# EAGLE design InkTime_NAN (EAGLE 9.7.0)

## Sheet 1 of 2
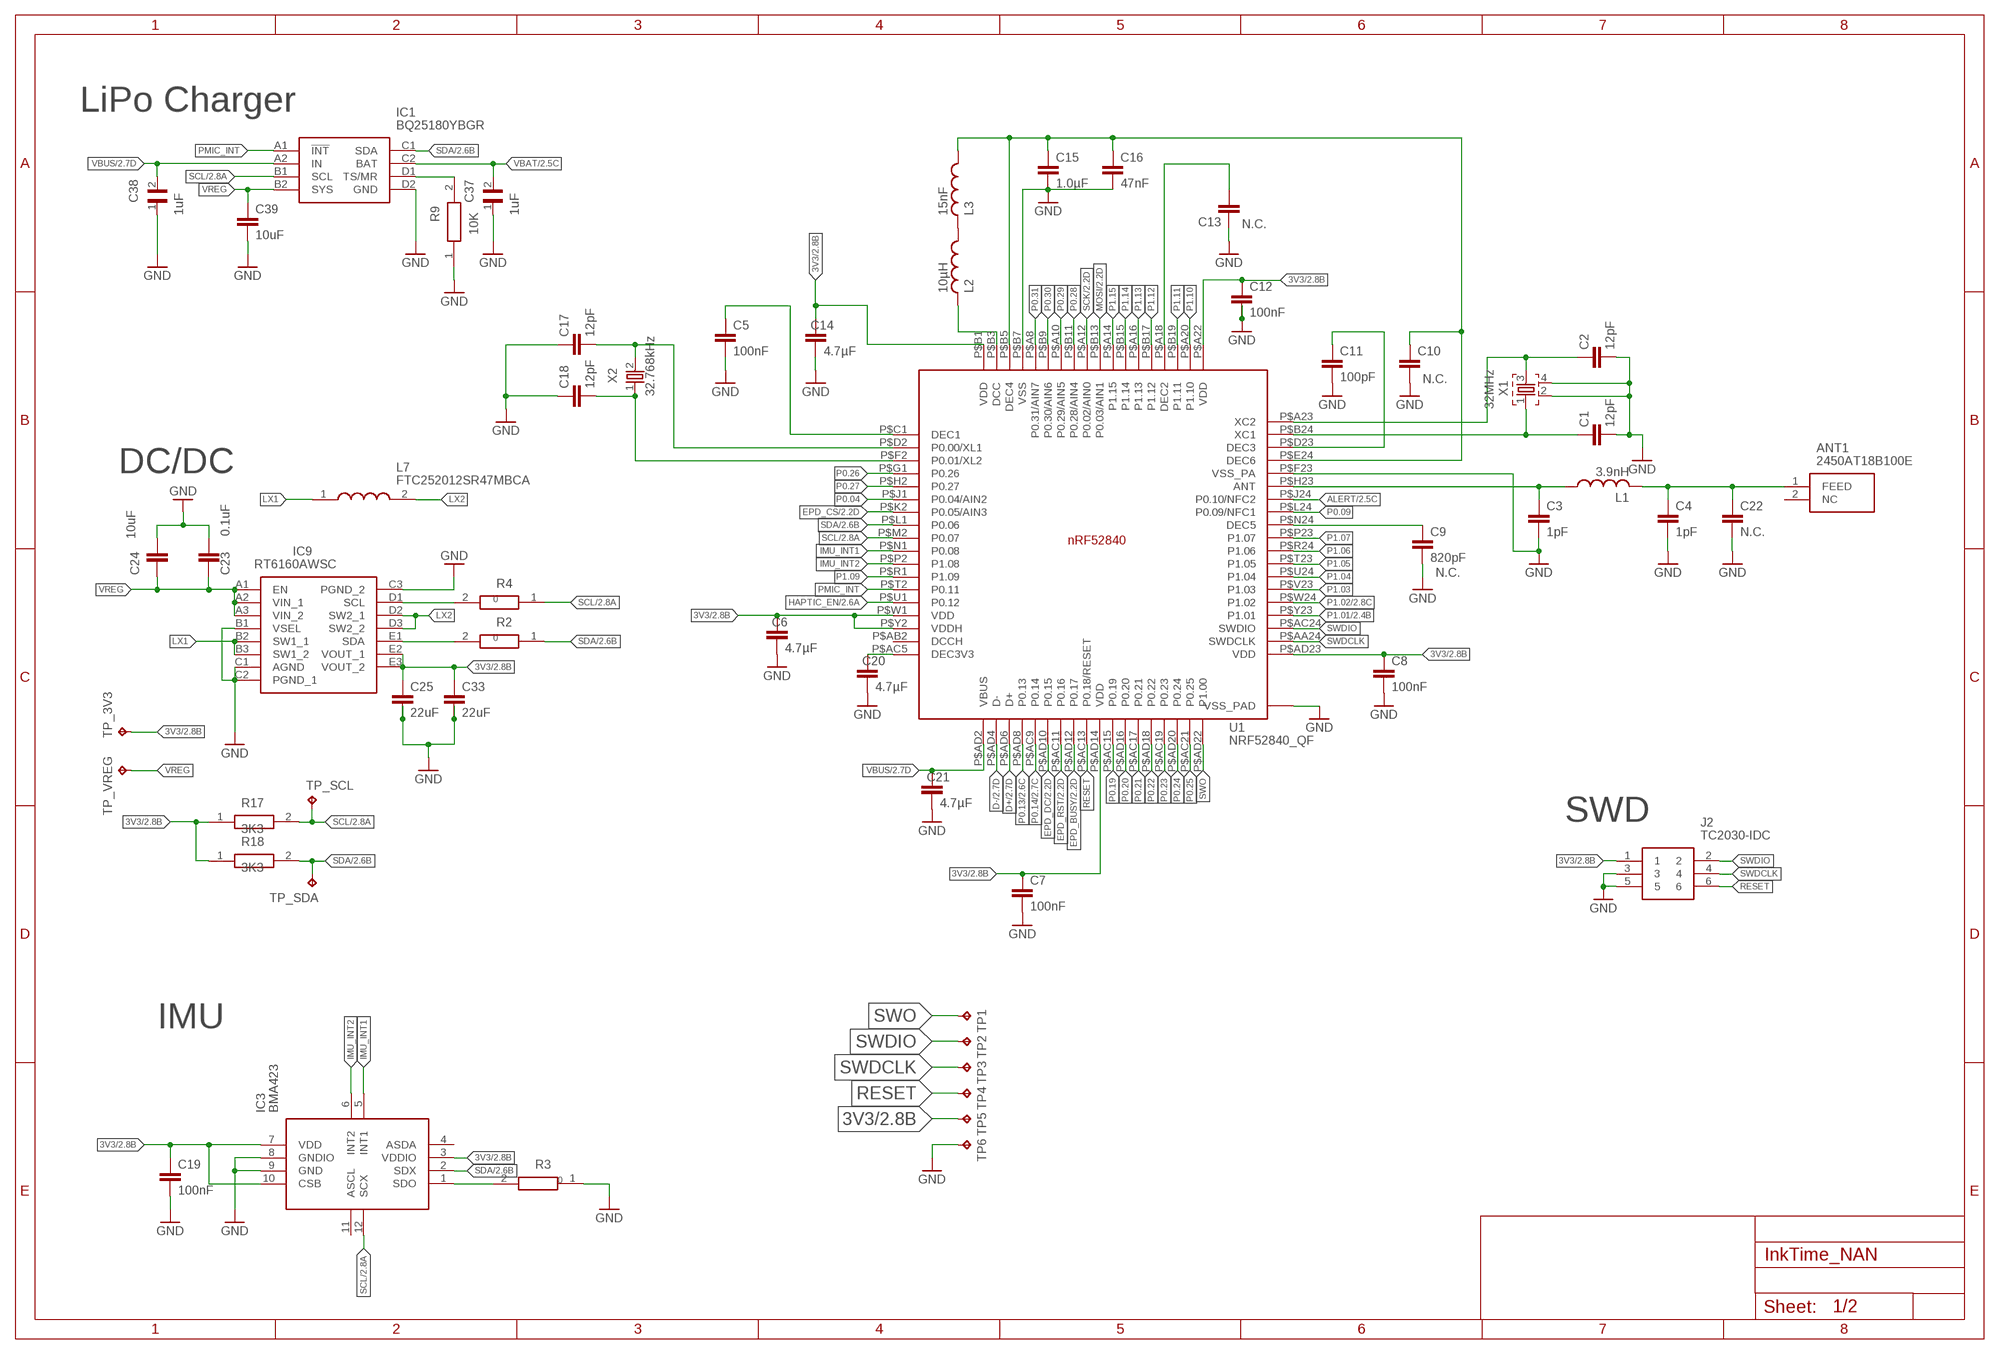
[diagram p0: schematic, sheet 1]

### Parts
ANT1  2450AT18B100E  2450AT18B100E_2450AT18B100E  [2450AT18B100E_ANTC3216X140N]
C1  12pF  NORDIC_NRF_3_CAPACITOR_0201_L  [NORDIC_NRF_3_RESC0201_L]
C2  12pF  NORDIC_NRF_3_CAPACITOR_0201_L  [NORDIC_NRF_3_RESC0201_L]
C3  1pF  NORDIC_NRF_3_CAPACITOR_0201_L  [NORDIC_NRF_3_RESC0201_L]
C4  1pF  NORDIC_NRF_3_CAPACITOR_0201_L  [NORDIC_NRF_3_RESC0201_L]
C5  100nF  NORDIC_NRF_3_CAPACITOR_0201_L  [NORDIC_NRF_3_RESC0201_L]
C6  4.7µF  NORDIC_NRF_3_CAPACITOR_0402_L  [NORDIC_NRF_3_RESC0402_L]
C7  100nF  NORDIC_NRF_3_CAPACITOR_0201_L  [NORDIC_NRF_3_RESC0201_L]
C8  100nF  NORDIC_NRF_3_CAPACITOR_0201_L  [NORDIC_NRF_3_RESC0201_L]
C9  820pF  NORDIC_NRF_3_CAPACITOR_0201_L  [NORDIC_NRF_3_RESC0201_L]
C10  NORDIC_NRF_3_CAPACITOR_0201_L  [NORDIC_NRF_3_RESC0201_L]
C11  100pF  NORDIC_NRF_3_CAPACITOR_0201_L  [NORDIC_NRF_3_RESC0201_L]
C12  100nF  NORDIC_NRF_3_CAPACITOR_0201_L  [NORDIC_NRF_3_RESC0201_L]
C13  NORDIC_NRF_3_CAPACITOR_0201_L  [NORDIC_NRF_3_RESC0201_L]
C14  4.7µF  NORDIC_NRF_3_CAPACITOR_0402_L  [NORDIC_NRF_3_RESC0402_L]
C15  1.0µF  NORDIC_NRF_3_CAPACITOR_0402_L  [NORDIC_NRF_3_RESC0402_L]
C16  47nF  NORDIC_NRF_3_CAPACITOR_0201_L  [NORDIC_NRF_3_RESC0201_L]
C17  12pF  NORDIC_NRF_3_CAPACITOR_0201_L  [NORDIC_NRF_3_RESC0201_L]
C18  12pF  NORDIC_NRF_3_CAPACITOR_0201_L  [NORDIC_NRF_3_RESC0201_L]
C19  100nF  NORDIC_NRF_3_CAPACITOR_0201_L  [NORDIC_NRF_3_RESC0201_L]
C20  4.7µF  NORDIC_NRF_3_CAPACITOR_0402_L  [NORDIC_NRF_3_RESC0402_L]
C21  4.7µF  NORDIC_NRF_3_CAPACITOR_0402_L  [NORDIC_NRF_3_RESC0402_L]
C22  N.C.  NORDIC_NRF_3_CAPACITOR_0201_L  [NORDIC_NRF_3_RESC0201_L]
C23  0.1uF  NORDIC_NRF_3_CAPACITOR_0201_L  [NORDIC_NRF_3_RESC0201_L]
C24  10uF  NORDIC_NRF_3_CAPACITOR_0402_L  [NORDIC_NRF_3_RESC0402_L]
C25  22uF  NORDIC_NRF_3_CAPACITOR_0402_L  [NORDIC_NRF_3_RESC0402_L]
C33  22uF  NORDIC_NRF_3_CAPACITOR_0402_L  [NORDIC_NRF_3_RESC0402_L]
C37  1uF  GRM011R60J152KE01L_2_GRM011R60J152KE01L  [GRM011R60J152KE01L_2_CAPC0201X13N]
C38  1uF  GRM011R60J152KE01L_2_GRM011R60J152KE01L  [GRM011R60J152KE01L_2_CAPC0201X13N]
C39  10uF  NORDIC_NRF_3_CAPACITOR_0402_L  [NORDIC_NRF_3_RESC0402_L]
IC1  BQ25180YBGR  BQ25180YBGR_BQ25180YBGR  [BQ25180YBGR_BGA8C40P2X4_100X155X50]
IC3  BMA423  BMA423_BMA423  [BMA423_BMA423]
IC9  RT6160AWSC  RT6160AWSC_RT6160AWSC  [RT6160AWSC_BGA15C40P3X5_140X230X60]
J2  TC2030-IDC  TC2030-IDC_TC2030-IDC  [TC2030-IDC_TC2030IDC]
L1  3.9nH  NORDIC_NRF_2_INDUCTOR_0402_L  [NORDIC_NRF_2_RESC0402_L]
L2  10µH  NORDIC_NRF_2_INDUCTOR_0402_L  [NORDIC_NRF_2_RESC0402_L]
L3  15nF  NORDIC_NRF_2_INDUCTOR_0402_L  [NORDIC_NRF_2_RESC0402_L]
L7  FTC252012SR47MBCA  MLP2016SR47MT0S1_FTC252012SR47MBCA  [MLP2016SR47MT0S1_INDC2016X100N]
R2  CPF0201D7K68C1_CPF0201D7K68C1  [CPF0201D7K68C1_0201]
R3  CPF0201D7K68C1_CPF0201D7K68C1  [CPF0201D7K68C1_0201]
R4  CPF0201D7K68C1_CPF0201D7K68C1  [CPF0201D7K68C1_0201]
R9  10K  CPF0201D7K68C1_CPF0201D7K68C1  [CPF0201D7K68C1_0201]
R17  3K3  CPF0201D7K68C1_CPF0201D7K68C1  [CPF0201D7K68C1_0201]
R18  3K3  CPF0201D7K68C1_CPF0201D7K68C1  [CPF0201D7K68C1_0201]
TP1  HECTOR_WATCH_1_TPTP20R  [HECTOR_WATCH_1_TP20R]
TP2  HECTOR_WATCH_1_TPTP20R  [HECTOR_WATCH_1_TP20R]
TP3  HECTOR_WATCH_1_TPTP20R  [HECTOR_WATCH_1_TP20R]
TP4  HECTOR_WATCH_1_TPTP20R  [HECTOR_WATCH_1_TP20R]
TP5  HECTOR_WATCH_1_TPTP20R  [HECTOR_WATCH_1_TP20R]
TP6  HECTOR_WATCH_1_TPTP20R  [HECTOR_WATCH_1_TP20R]
TP_3V3  HECTOR_WATCH_1_TPTP20R  [HECTOR_WATCH_1_TP20R]
TP_SCL  HECTOR_WATCH_1_TPTP20R  [HECTOR_WATCH_1_TP20R]
TP_SDA  HECTOR_WATCH_1_TPTP20R  [HECTOR_WATCH_1_TP20R]
TP_VREG  HECTOR_WATCH_1_TPTP20R  [HECTOR_WATCH_1_TP20R]
U1  NRF52840_QF  NORDIC_NRF_4_NRF52840_QF  [NORDIC_NRF_4_AQFN50P700X700X85_HS-74N]
X1  32MHz  NORDIC_NRF_XTAL_32MHZ  [NORDIC_NRF_BT-XTAL_2016_N]
X2  32.768kHz  NORDIC_NRF_1_XTAL_32KHZ  [NORDIC_NRF_1_XTAL_3215_N]

### Nets
3V3: C6.1 C7.1 C8.1 C12.1 C14.1 C19.1 C25.1 C33.1 IC3.3(VDDIO) IC3.7(VDD) IC3.10(CSB) IC9.E2(VOUT_1) IC9.E3(VOUT_2) J2.1 R17.1 R18.1 TP5.TP TP_3V3.TP U1.P$A22(VDD) U1.P$AD14(VDD) U1.P$AD23(VDD) U1.P$B1(VDD) U1.P$W1(VDD) U1.P$Y2(VDDH) ; also sheet 2
ALERT: U1.P$J24(P0.10/NFC2) ; also sheet 2
D+: U1.P$AD6(D+) ; also sheet 2
D-: U1.P$AD4(D-) ; also sheet 2
EPD_BUSY: U1.P$AD12(P0.17) ; also sheet 2
EPD_CS: U1.P$K2(P0.05/AIN3) ; also sheet 2
EPD_DC: U1.P$AD10(P0.15) ; also sheet 2
EPD_RST: U1.P$AC11(P0.16) ; also sheet 2
GND: C1.2 C2.2 C3.2 C4.2 C5.2 C6.2 C7.2 C8.2 C9.2 C10.1 C11.2 C12.2 C13.1 C14.2 C15.2 C16.2 C17.1 C18.1 C19.2 C20.2 C21.2 C22.2 C23.1 C24.1 C25.2 C33.2 C37.1 C38.1 C39.2 IC1.D2(GND) IC3.8(GNDIO) IC3.9(GND) IC9.B1(VSEL) IC9.C1(AGND) IC9.C2(PGND_1) IC9.C3(PGND_2) J2.3 J2.5 R3.1 R9.1 TP6.TP U1.P$74(VSS_PAD) U1.P$75(VSS_PAD) U1.P$76(VSS_PAD) U1.P$77(VSS_PAD) U1.P$78(VSS_PAD) U1.P$79(VSS_PAD) U1.P$80(VSS_PAD) U1.P$81(VSS_PAD) U1.P$82(VSS_PAD) U1.P$83(VSS_PAD) U1.P$84(VSS_PAD) U1.P$85(VSS_PAD) U1.P$86(VSS_PAD) U1.P$87(VSS_PAD) U1.P$88(VSS_PAD) U1.P$89(VSS_PAD) U1.P$90(VSS_PAD) U1.P$B7(VSS) U1.P$F23(VSS_PA) X1.2 X1.4 ; also sheet 2
HAPTIC_EN: U1.P$U1(P0.12) ; also sheet 2
IMU_INT1: IC3.5(INT1) U1.P$N1(P0.08)
IMU_INT2: IC3.6(INT2) U1.P$P2(P1.08)
LX1: IC9.B2(SW1_1) IC9.B3(SW1_2) L7.1
LX2: IC9.D2(SW2_1) IC9.D3(SW2_2) L7.2
MOSI: U1.P$B13(P0.03/AIN1) ; also sheet 2
N$1: C5.1 U1.P$C1(DEC1)
N$2: C9.1 U1.P$N24(DEC5)
N$3: C11.1 U1.P$D23(DEC3)
N$4: IC9.D1(SCL) R4.2
N$5: C17.2 U1.P$D2(P0.00/XL1) X2.2
N$6: C18.2 U1.P$F2(P0.01/XL2) X2.1
N$9: C3.1 L1.1 U1.P$H23(ANT)
N$10: ANT1.1(FEED) C4.1 C22.1 L1.2
N$12: C10.2 C15.1 C16.1 L3.1 U1.P$B5(DEC4) U1.P$E24(DEC6)
N$13: C2.1 U1.P$A23(XC2) X1.3
N$14: C1.1 U1.P$B24(XC1) X1.1
N$15: L2.1 L3.2
N$16: L2.2 U1.P$B3(DCC)
N$17: C13.2 U1.P$A18(DEC2)
N$18: IC3.1(SDO) R3.2
N$19: C20.1 U1.P$AC5(DEC3V3)
N$21: IC9.E1(SDA) R2.2
N$24: IC1.D1(TS/MR) R9.2
P0.04: U1.P$J1(P0.04/AIN2)
P0.09: U1.P$L24(P0.09/NFC1)
P0.13: U1.P$AD8(P0.13) ; also sheet 2
P0.14: U1.P$AC9(P0.14) ; also sheet 2
P0.19: U1.P$AC15(P0.19)
P0.20: U1.P$AD16(P0.20)
P0.21: U1.P$AC17(P0.21)
P0.22: U1.P$AD18(P0.22)
P0.23: U1.P$AC19(P0.23)
P0.24: U1.P$AD20(P0.24)
P0.25: U1.P$AC21(P0.25)
P0.26: U1.P$G1(P0.26)
P0.27: U1.P$H2(P0.27)
P0.28: U1.P$B11(P0.28/AIN4)
P0.29: U1.P$A10(P0.29/AIN5)
P0.30: U1.P$B9(P0.30/AIN6)
P0.31: U1.P$A8(P0.31/AIN7)
P1.01: U1.P$Y23(P1.01) ; also sheet 2
P1.02: U1.P$W24(P1.02) ; also sheet 2
P1.03: U1.P$V23(P1.03)
P1.04: U1.P$U24(P1.04)
P1.05: U1.P$T23(P1.05)
P1.06: U1.P$R24(P1.06)
P1.07: U1.P$P23(P1.07)
P1.09: U1.P$R1(P1.09)
P1.10: U1.P$A20(P1.10)
P1.11: U1.P$B19(P1.11)
P1.12: U1.P$B17(P1.12)
P1.13: U1.P$A16(P1.13)
P1.14: U1.P$B15(P1.14)
P1.15: U1.P$A14(P1.15)
PMIC_INT: IC1.A1(!INT) U1.P$T2(P0.11)
RESET: J2.6 TP4.TP U1.P$AC13(P0.18/RESET)
SCK: U1.P$A12(P0.02/AIN0) ; also sheet 2
SCL: IC1.B1(SCL) IC3.12(SCX) R4.1 R17.2 TP_SCL.TP U1.P$M2(P0.07) ; also sheet 2
SDA: IC1.C1(SDA) IC3.2(SDX) R2.1 R18.2 TP_SDA.TP U1.P$L1(P0.06) ; also sheet 2
SWDCLK: J2.4 TP3.TP U1.P$AA24(SWDCLK)
SWDIO: J2.2 TP2.TP U1.P$AC24(SWDIO)
SWO: TP1.TP U1.P$AD22(P1.00)
VBAT: C37.2 IC1.C2(BAT) ; also sheet 2
VBUS: C21.1 C38.2 IC1.A2(IN) U1.P$AD2(VBUS) ; also sheet 2
VREG: C23.2 C24.2 C39.1 IC1.B2(SYS) IC9.A1(EN) IC9.A2(VIN_1) IC9.A3(VIN_2) TP_VREG.TP
Unconnected: ANT1.2(NC) IC3.4(ASDA) IC3.11(ASCL) U1.P$AB2(DCCH)

### Notes on the sheet
- LiPo Charger
- N.C.
- N.C.
- DC/DC
- N.C.
- 0
- 0
- SWD
- IMU
- 0

## Sheet 2 of 2
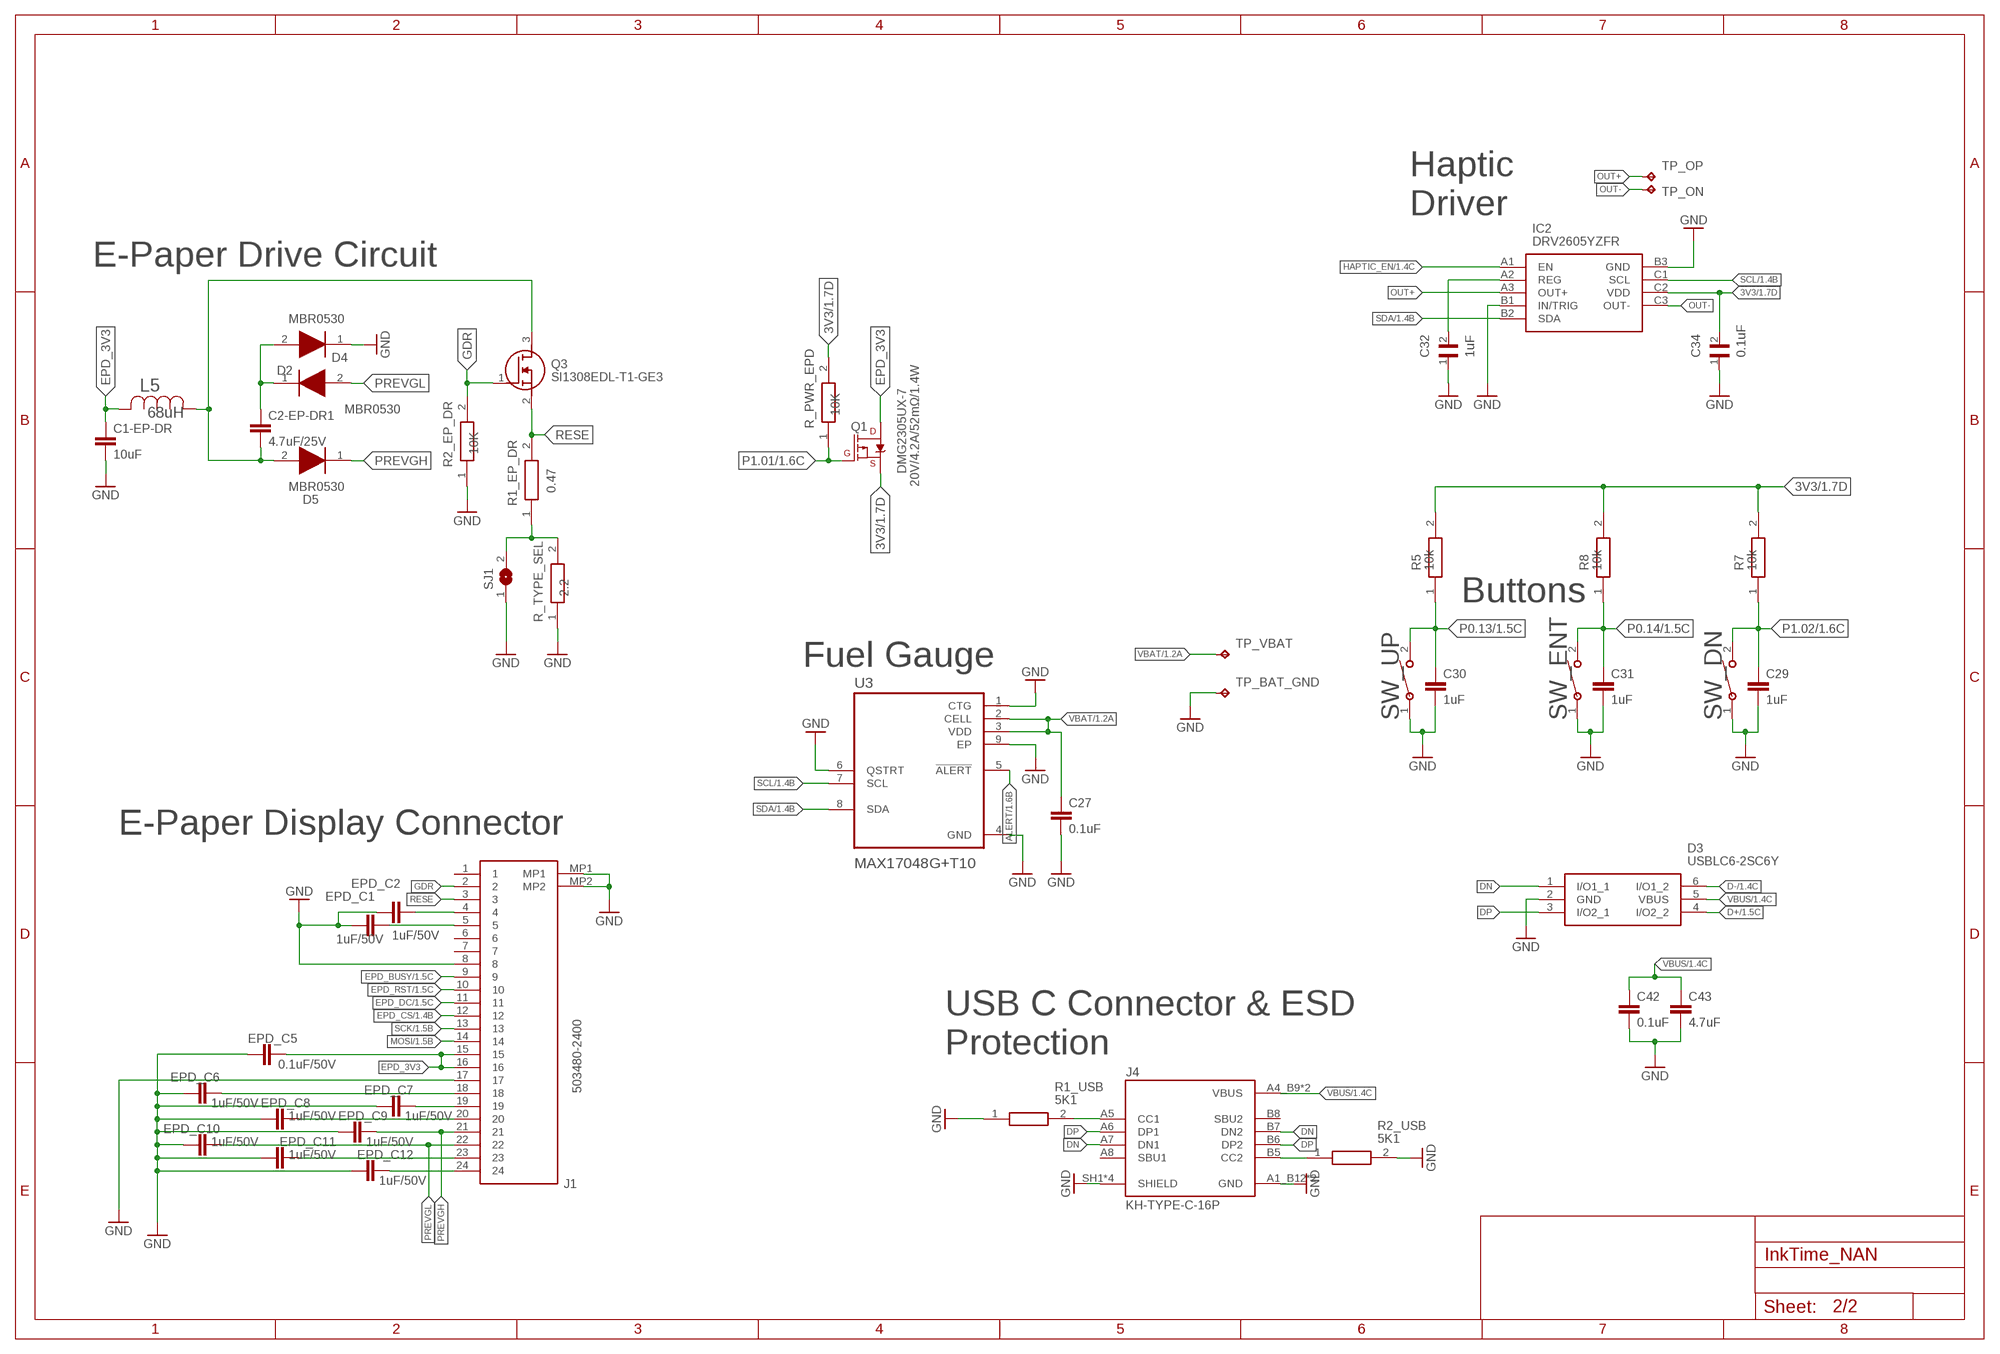
[diagram p1: schematic, sheet 2]

### Parts
C1-EP-DR  10uF  NORDIC_NRF_3_CAPACITOR_0402_L  [NORDIC_NRF_3_RESC0402_L]
C2-EP-DR1  4.7uF/25V  NORDIC_NRF_3_CAPACITOR_0402_L  [NORDIC_NRF_3_RESC0402_L]
C27  0.1uF  NORDIC_NRF_3_CAPACITOR_0201_L  [NORDIC_NRF_3_RESC0201_L]
C29  1uF  NORDIC_NRF_3_CAPACITOR_0402_L  [NORDIC_NRF_3_RESC0402_L]
C30  1uF  NORDIC_NRF_3_CAPACITOR_0402_L  [NORDIC_NRF_3_RESC0402_L]
C31  1uF  NORDIC_NRF_3_CAPACITOR_0402_L  [NORDIC_NRF_3_RESC0402_L]
C32  1uF  GRM011R60J152KE01L_2_GRM011R60J152KE01L  [GRM011R60J152KE01L_2_CAPC0201X13N]
C34  0.1uF  GRM011R60J152KE01L_2_GRM011R60J152KE01L  [GRM011R60J152KE01L_2_CAPC0201X13N]
C42  0.1uF  NORDIC_NRF_3_CAPACITOR_0201_L  [NORDIC_NRF_3_RESC0201_L]
C43  4.7uF  NORDIC_NRF_3_CAPACITOR_0402_L  [NORDIC_NRF_3_RESC0402_L]
D2  MBR0530  ESP32_C6_LIBRARY_5_MBR0530  [ESP32_C6_LIBRARY_5_SOD3716X135N]
D3  USBLC6-2SC6Y  ESP32_C6_LIBRARY_3_USBLC6-2SC6Y  [ESP32_C6_LIBRARY_3_SOT95P280X145-6N]
D4  MBR0530  ESP32_C6_LIBRARY_5_MBR0530  [ESP32_C6_LIBRARY_5_SOD3716X135N]
D5  MBR0530  ESP32_C6_LIBRARY_5_MBR0530  [ESP32_C6_LIBRARY_5_SOD3716X135N]
EPD_C1  1uF/50V  NORDIC_NRF_3_CAPACITOR_0402_L  [NORDIC_NRF_3_RESC0402_L]
EPD_C2  1uF/50V  NORDIC_NRF_3_CAPACITOR_0402_L  [NORDIC_NRF_3_RESC0402_L]
EPD_C5  0.1uF/50V  NORDIC_NRF_3_CAPACITOR_0201_L  [NORDIC_NRF_3_RESC0201_L]
EPD_C6  1uF/50V  NORDIC_NRF_3_CAPACITOR_0402_L  [NORDIC_NRF_3_RESC0402_L]
EPD_C7  1uF/50V  NORDIC_NRF_3_CAPACITOR_0402_L  [NORDIC_NRF_3_RESC0402_L]
EPD_C8  1uF/50V  NORDIC_NRF_3_CAPACITOR_0402_L  [NORDIC_NRF_3_RESC0402_L]
EPD_C9  1uF/50V  NORDIC_NRF_3_CAPACITOR_0402_L  [NORDIC_NRF_3_RESC0402_L]
EPD_C10  1uF/50V  NORDIC_NRF_3_CAPACITOR_0402_L  [NORDIC_NRF_3_RESC0402_L]
EPD_C11  1uF/50V  NORDIC_NRF_3_CAPACITOR_0402_L  [NORDIC_NRF_3_RESC0402_L]
EPD_C12  1uF/50V  NORDIC_NRF_3_CAPACITOR_0402_L  [NORDIC_NRF_3_RESC0402_L]
IC2  DRV2605YZFR  DRV2605YZFR_DRV2605YZFR  [DRV2605YZFR_BGA9C50P3X3_144X144X62]
J1  503480-2400  503480-2400_503480-2400  [503480-2400_5034802400]
J4  KH-TYPE-C-16P  KH-TYPE-C-16P_KH-TYPE-C-16P  [KH-TYPE-C-16P_KINGHELM_KH-TYPE-C-16P]
L5  68uH  ESP32_C6_LIBRARY_2_744043680IND_4828-WE-TPC_WRE  [ESP32_C6_LIBRARY_2_IND_4828-WE-TPC_WRE]
Q1  20V/4.2A/52mΩ/1.4W  ESP32_C6_LIBRARY_4_ESP32_WROVER_SPARKFUN-DISCRETESEMI_MOSFET_PCH-DMG2305UX-7  [ESP32_C6_LIBRARY_4_ESP32_C6_LIBRARY_4_ESP32_C6_LIBRARY_4_ESP32_C6_LIBRARY_4_ESP32_WROVER_SPARKFUN-DISCRETESEMI_SOT23-3]
Q3  SI1308EDL-T1-GE3  ESP32_C6_LIBRARY_6_SI1308EDL-T1-GE3  [ESP32_C6_LIBRARY_6_SOT65P210X110-3N]
R1_EP_DR  0.47  CPF0201D7K68C1_CPF0201D7K68C1  [CPF0201D7K68C1_0201]
R1_USB  5K1  ERA-1AEB3401C_CPF0201D7K68C1  [ERA-1AEB3401C_0201]
R2_EP_DR  10K  CPF0201D7K68C1_CPF0201D7K68C1  [CPF0201D7K68C1_0201]
R2_USB  5K1  ERA-1AEB3401C_CPF0201D7K68C1  [ERA-1AEB3401C_0201]
R5  10k  CPF0201D7K68C1_CPF0201D7K68C1  [CPF0201D7K68C1_0201]
R7  10k  CPF0201D7K68C1_CPF0201D7K68C1  [CPF0201D7K68C1_0201]
R8  10k  CPF0201D7K68C1_CPF0201D7K68C1  [CPF0201D7K68C1_0201]
R_PWR_EPD  10K  CPF0201D7K68C1_CPF0201D7K68C1  [CPF0201D7K68C1_0201]
R_TYPE_SEL  2.2  CPF0201D7K68C1_CPF0201D7K68C1  [CPF0201D7K68C1_0201]
SJ1  ESP32_C6_LIBRARY_7_JUMPER_SJ  [ESP32_C6_LIBRARY_7_JUMPER_SJ]
SW_DN  2025-10-22_07-23-44_LIBRARY_EVP-AKE31ASW_EVP-AKE31A_PAN  [2025-10-22_07-23-44_LIBRARY_SW_EVP-AKE31A_PAN]
SW_ENT  SW_ENT  2025-10-22_07-23-44_LIBRARY_EVP-AKE31ASW_EVP-AKE31A_PAN  [2025-10-22_07-23-44_LIBRARY_SW_EVP-AKE31A_PAN]
SW_UP  2025-10-22_07-23-44_LIBRARY_EVP-AKE31ASW_EVP-AKE31A_PAN  [2025-10-22_07-23-44_LIBRARY_SW_EVP-AKE31A_PAN]
TP_BAT_GND  HECTOR_WATCH_1_TPTP20R  [HECTOR_WATCH_1_TP20R]
TP_ON  HECTOR_WATCH_1_TPTP20R  [HECTOR_WATCH_1_TP20R]
TP_OP  HECTOR_WATCH_1_TPTP20R  [HECTOR_WATCH_1_TP20R]
TP_VBAT  HECTOR_WATCH_1_TPTP20R  [HECTOR_WATCH_1_TP20R]
U3  MAX17048G+T10  ESP32_C6_LIBRARY_MAX17048G+T10  [ESP32_C6_LIBRARY_SON50P200X200X80-9N]

### Nets
3V3: C34.2 IC2.C2(VDD) Q1.2(S) R5.2 R7.2 R8.2 R_PWR_EPD.2 ; also sheet 1
ALERT: U3.5(!ALERT) ; also sheet 1
D+: D3.4(I/O2_2) ; also sheet 1
D-: D3.6(I/O1_2) ; also sheet 1
DN: D3.1(I/O1_1) J4.A7(DN1) J4.B7(DN2)
DP: D3.3(I/O2_1) J4.A6(DP1) J4.B6(DP2)
EPD_3V3 [Power]: C1-EP-DR.1 EPD_C5.2 J1.15 J1.16 L5.2 Q1.3(D)
EPD_BUSY: J1.9 ; also sheet 1
EPD_CS: J1.12 ; also sheet 1
EPD_DC: J1.11 ; also sheet 1
EPD_RST: J1.10 ; also sheet 1
GDR: J1.2 Q3.1(G) R2_EP_DR.2
GND: C1-EP-DR.2 C27.2 C29.2 C30.2 C31.2 C32.1 C34.1 C42.2 C43.2 D2.1(K) D3.2(GND) EPD_C1.1 EPD_C2.1 EPD_C5.1 EPD_C6.1 EPD_C7.1 EPD_C8.1 EPD_C9.1 EPD_C10.1 EPD_C11.1 EPD_C12.1 IC2.B1(IN/TRIG) IC2.B3(GND) J1.8 J1.17 J1.MP1 J1.MP2 J4.A1_B12(GND) J4.A12_B1(GND) J4.SH1(SHIELD) J4.SH2(SHIELD) J4.SH3(SHIELD) J4.SH4(SHIELD) R1_USB.1 R2_EP_DR.1 R2_USB.2 R_TYPE_SEL.1 SJ1.1 SW_DN.1 SW_ENT.1 SW_UP.1 TP_BAT_GND.TP U3.1(CTG) U3.4(GND) U3.6(QSTRT) U3.9(EP) ; also sheet 1
HAPTIC_EN: IC2.A1(EN) ; also sheet 1
MOSI: J1.14 ; also sheet 1
N$7: C2-EP-DR1.2 D5.2(A) L5.1 Q3.3(D)
N$23: EPD_C8.2 J1.20
N$25: C2-EP-DR1.1 D2.2(A) D4.1(K)
N$27: EPD_C2.2 J1.4
N$29: R1_EP_DR.1 R_TYPE_SEL.2 SJ1.2
N$31: EPD_C1.2 J1.5
N$32: C32.2 IC2.A2(REG)
N$34: J4.B5(CC2) R2_USB.1
N$37: J4.A5(CC1) R1_USB.2
N$39: EPD_C7.2 J1.19
N$41: EPD_C6.2 J1.18
N$42: EPD_C11.2 J1.23
N$44: EPD_C12.2 J1.24
OUT+: IC2.A3(OUT+) TP_OP.TP
OUT-: IC2.C3(OUT-) TP_ON.TP
P0.13: C30.1 R5.1 SW_UP.2 ; also sheet 1
P0.14: C31.1 R8.1 SW_ENT.2 ; also sheet 1
P1.01: Q1.1(G) R_PWR_EPD.1 ; also sheet 1
P1.02: C29.1 R7.1 SW_DN.2 ; also sheet 1
PREVGH [Power]: D5.1(K) EPD_C9.2 J1.21
PREVGL [Power]: D4.2(A) EPD_C10.2 J1.22
RESE: J1.3 Q3.2(S) R1_EP_DR.2
SCK: J1.13 ; also sheet 1
SCL: IC2.C1(SCL) U3.7(SCL) ; also sheet 1
SDA: IC2.B2(SDA) U3.8(SDA) ; also sheet 1
VBAT: C27.1 TP_VBAT.TP U3.2(CELL) U3.3(VDD) ; also sheet 1
VBUS: C42.1 C43.1 D3.5(VBUS) J4.A4_B9(VBUS) J4.A9_B4(VBUS) ; also sheet 1
Unconnected: J1.1 J1.6 J1.7 J4.A8(SBU1) J4.B8(SBU2)

### Notes on the sheet
- Haptic
  Driver
- E-Paper Drive Circuit
- DMG2305UX-7
- Buttons
- Fuel Gauge
- E-Paper Display Connector
- USB C Connector & ESD
  Protection

## Library data of the parts
ANT1 = InkTime_v5:2450AT18B100E_2450AT18B100E: Antennas 2.45GHz ANTENNA Source: Datasheet <https://www.johansontechnology.com/datasheets/2450AT18B100/2450AT18B100.pdf>; ARROW_PART_NUMBER: 2450AT18B100E; ARROW_PRICE-STOCK: https://www.arrow.com/en/products/2450at18b100e/johanson-dielectrics?utm_currency=USD&region=nac; DESCRIPTION: Antennas 2.45GHz ANTENNA; HEIGHT: 1.4mm; MANUFACTURER_NAME: JOHANSON TECHNOLOGY; MANUFACTURER_PART_NUMBER: 2450AT18B100E; MOUSER_PART_NUMBER: 609-2450AT18B100E; MOUSER_PRICE-STOCK: https://www.mouser.co.uk/ProductDetail/Johanson-Technology/2450AT18B100E?qs=yCnrNFeXz%252Bh5MFsFIXGZGA%3D%3D
C1 C1-EP-DR C2 C2-EP-DR1 C3-C25 C27 C29-C31 C33 C39 C42 C43 EPD_C1 EPD_C2 EPD_C5-EPD_C12 = InkTime_v5:NORDIC_NRF_3_CAPACITOR: Generic chip capacitor
C32 C34 C37 C38 = InkTime_v5:GRM011R60J152KE01L_2_GRM011R60J152KE01L: Check availability <https://pricing.snapeda.com/parts/GRM011R60J152KE01L/Murata/view-part?ref=eda>; AVAILABILITY: In Stock; CHECK_PRICES: https://www.snapeda.com/parts/GRM011R60J152KE01L/Murata/view-part/?ref=eda; DESCRIPTION: SMD Capacitor X5R(EIA) with Capacitance: 1500pF Tol. 10%. Rated Voltage: 6.3Vdc; MF: Murata; MP: GRM011R60J152KE01L; PACKAGE: 0201 Murata; PRICE: None; SNAPEDA_LINK: https://www.snapeda.com/parts/GRM011R60J152KE01L/Murata/view-part/?ref=snap
D2 D4 D5 = InkTime_v5:ESP32_C6_LIBRARY_5_MBR0530: ON SEMICONDUCTOR - MBR0530 - DIODE, SCHOTTKY, 0.5A, 30V, SOD-123 Source: Datasheet <http://www.onsemi.com/pub/Collateral/MBR0530T1-D.PDF> Check availability <https://pricing.snapeda.com/parts/MBR0530/ON%20Semiconductor/view-part?ref=eda>; AVAILABILITY: In Stock; CHECK_PRICES: https://www.snapeda.com/parts/MBR0530/Onsemi/view-part/?ref=eda; DESCRIPTION: Diode Schottky 30 V 500mA Surface Mount SOD-123; MF: ON Semiconductor; MP: MBR0530; PACKAGE: SOD-123-2 ON Semiconductor; PRICE: None; PURCHASE-URL: https://www.snapeda.com/api/url_track_click_mouser/?unipart_id=179458&manufacturer=ON Semiconductor&part_name=MBR0530&search_term=None; SNAPEDA_LINK: https://www.snapeda.com/parts/MBR0530/Onsemi/view-part/?ref=snap
D3 = InkTime_v5:ESP32_C6_LIBRARY_3_USBLC6-2SC6Y: Low Cap. ESD Protection Auto SOT-23-6 STMicroelectronics USBLC6-2SC6Y, Dual Uni-Directional TVS Diode Array, 6-Pin SOT-23 Source: Datasheet <https://componentsearchengine.com/Datasheets/1/USBLC6-2SC6Y.pdf> Check availability <https://pricing.snapeda.com/parts/USBLC6-2SC6Y/STMicroelectronics/view-part?ref=eda>; AVAILABILITY: In Stock; CHECK_PRICES: https://www.snapeda.com/parts/USBLC6-2SC6Y/STMicroelectronics/view-part/?ref=eda; DESCRIPTION: 17V Clamp 5A (8/20µs) Ipp Tvs Diode Surface Mount SOT-23-6; MF: STMicroelectronics; MP: USBLC6-2SC6Y; PACKAGE: SOT-23-6 STMicroelectronics; PRICE: None; SNAPEDA_LINK: https://www.snapeda.com/parts/USBLC6-2SC6Y/STMicroelectronics/view-part/?ref=snap
IC1 = InkTime_v5:BQ25180YBGR_BQ25180YBGR: Charger IC Lithium Ion/Polymer, Lithium Iron Phosphate 8-DSBGA (1.6x1.1) Source: Datasheet <https://www.ti.com/lit/ds/symlink/bq25180.pdf?ts=1650264094470&ref_url=https%3A%2F%2Fwww.ti.com%2Fproduct%2FBQ25180>; ARROW_PART_NUMBER: BQ25180YBGR; ARROW_PRICE-STOCK: https://www.arrow.com/en/products/bq25180ybgr/texas-instruments?utm_currency=USD&region=nac; DESCRIPTION: Charger IC Lithium Ion/Polymer, Lithium Iron Phosphate 8-DSBGA (1.6x1.1); HEIGHT: 0.5mm; MANUFACTURER_NAME: Texas Instruments; MANUFACTURER_PART_NUMBER: BQ25180YBGR; MOUSER_PART_NUMBER: 595-BQ25180YBGR; MOUSER_PRICE-STOCK: https://www.mouser.co.uk/ProductDetail/Texas-Instruments/BQ25180YBGR?qs=doiCPypUmgEWjAK%252BJAX6Tw%3D%3D
IC2 = InkTime_v5:DRV2605YZFR_DRV2605YZFR: Haptic Driver for ERM/LRA with Built-In Library and Smart Loop Architecture Source: Datasheet <http://www.ti.com/lit/gpn/drv2605>; ARROW_PART_NUMBER: DRV2605YZFR; ARROW_PRICE-STOCK: https://www.arrow.com/en/products/drv2605yzfr/texas-instruments?region=nac; DESCRIPTION: Haptic Driver for ERM/LRA with Built-In Library and Smart Loop Architecture; HEIGHT: 0.625mm; MANUFACTURER_NAME: Texas Instruments; MANUFACTURER_PART_NUMBER: DRV2605YZFR
IC3 = InkTime_v5:BMA423_BMA423: Accelerometers Triaxial low-g 12bit Acceleration Sensor Source: Datasheet <https://www.mouser.com/datasheet/2/783/BST-BMA423-DS000-1509600.pdf>; ARROW_PART_NUMBER: BMA423; ARROW_PRICE-STOCK: https://www.arrow.com/en/products/bma423/bosch; DESCRIPTION: Accelerometers Triaxial low-g 12bit Acceleration Sensor; HEIGHT: 1mm; MANUFACTURER_NAME: BOSCH; MANUFACTURER_PART_NUMBER: BMA423; MOUSER_PART_NUMBER: 262-BMA423; MOUSER_PRICE-STOCK: https://www.mouser.co.uk/ProductDetail/Bosch-Sensortec/BMA423?qs=HXFqYaX1Q2xC%252BSgeGoX3mg%3D%3D
IC9 = InkTime_v5:RT6160AWSC_RT6160AWSC: Buck-Boost Regulator Positive Output Step-Up/Step-Down I2C DC-DC Controller IC 15-WL-CSP (BSC) (1.4x2.3) Source: Datasheet <https://www.richtek.com/SaveDownload.aspx?specid=RT6160A>; DESCRIPTION: Buck-Boost Regulator Positive Output Step-Up/Step-Down I2C DC-DC Controller IC 15-WL-CSP (BSC) (1.4x2.3); HEIGHT: 0.6mm; MANUFACTURER_NAME: RICHTEK; MANUFACTURER_PART_NUMBER: RT6160AWSC; MOUSER_PART_NUMBER: 835-RT6160AWSC; MOUSER_PRICE-STOCK: https://www.mouser.co.uk/ProductDetail/Richtek/RT6160AWSC?qs=amGC7iS6iy%2FLd9PSoixZXQ%3D%3D
J1 = InkTime_v5:503480-2400_503480-2400: FFC & FPC Connectors 0.5mm FPC RA SMT Dual Contact 24Ckt Source: Datasheet <https://componentsearchengine.com/Datasheets/1/503480-2400.pdf>; DESCRIPTION: FFC & FPC Connectors 0.5mm FPC RA SMT Dual Contact 24Ckt; HEIGHT: 1.87mm; MANUFACTURER_NAME: Molex; MANUFACTURER_PART_NUMBER: 503480-2400; MOUSER_PART_NUMBER: 538-503480-2400; MOUSER_PRICE-STOCK: https://www.mouser.co.uk/ProductDetail/Molex/503480-2400?qs=OAhjpuo3Vu7efIoxFh9AOw%3D%3D
J2 = InkTime_v5:TC2030-IDC_TC2030-IDC: CABLE ADAPTER 6 POS Source: Datasheet <https://datasheet.datasheetarchive.com/originals/distributors/Datasheets_SAMA/62bc384e093448baaaa63dbd0b9d8707.pdf>; DESCRIPTION: CABLE ADAPTER 6 POS; HEIGHT: 19mm; MANUFACTURER_NAME: Tag Connect; MANUFACTURER_PART_NUMBER: TC2030-IDC
J4 = InkTime_v5:KH-TYPE-C-16P_KH-TYPE-C-16P: Check availability <https://pricing.snapeda.com/parts/KH-TYPE-C-16P/kinghelm/view-part?ref=eda>; AVAILABILITY: Not in stock; CHECK_PRICES: https://www.snapeda.com/parts/KH-TYPE-C-16P/Kinghelm/view-part/?ref=eda; MF: kinghelm; MP: KH-TYPE-C-16P; PACKAGE: None; PRICE: None; SNAPEDA_LINK: https://www.snapeda.com/parts/KH-TYPE-C-16P/Kinghelm/view-part/?ref=snap
L1-L3 = InkTime_v5:NORDIC_NRF_2_INDUCTOR: Generic chip inductor
L5 = InkTime_v5:ESP32_C6_LIBRARY_2_744043680; COPYRIGHT: Copyright (C) 2024 Ultra Librarian. All rights reserved.; MANUFACTURER_PART_NUMBER: 744043680; MFR_NAME: Wurth Electronics
L7 = InkTime_v5:MLP2016SR47MT0S1_FTC252012SR47MBCA: SMD / SMT Inductors (Coils), L=0.47?H, L x W x T : Source: Datasheet <https://product.tdk.com/system/files/dam/doc/product/inductor/inductor/smd/catalog/inductor_commercial_power_mlp2016_en.pdf>; DESCRIPTION: SMD / SMT Inductors (Coils), L=0.47?H, L x W x T :; HEIGHT: 1mm; JLCPCB: https://jlcpcb.com/partdetail/6763488-FTC252012SR47MBCA/C5832368; MANUFACTURER_NAME: TDK; MANUFACTURER_PART_NUMBER: FTC252012SR47MBCA
Q1 = InkTime_v5:ESP32_C6_LIBRARY_4_ESP32_WROVER_SPARKFUN-DISCRETESEMI_MOSFET_PCH: P-channel MOSFETs Voltage controlled devices that allow control of high current outputs. SparkFun Products: SparkFun ESP32 Thing <https://www.sparkfun.com/products/13907> SparkFun ESP8266 Thing <https://www.sparkfun.com/products/13231> SparkFun Pi Servo HAT V2 <https://www.sparkfun.com/products/15316> DMG2305UX-7 (20V/4.2A/SOT23-3); PROD_ID: TRAN-14388
Q3 = InkTime_v5:ESP32_C6_LIBRARY_6_SI1308EDL-T1-GE3: MOSFET N-Ch 30V 1.5A TrenchFET SC70 Vishay Si1308EDL-T1-GE3 N-channel MOSFET Transistor, 1.5 A, 30 V, 3-Pin SC-70 Source: Datasheet <https://componentsearchengine.com/Datasheets/1/SI1308EDL-T1-GE3.pdf> Check availability <https://pricing.snapeda.com/parts/SI1308EDL-T1-GE3/Vishay%20Siliconix/view-part?ref=eda>; AVAILABILITY: In Stock; CHECK_PRICES: https://www.snapeda.com/parts/SI1308EDL-T1-GE3/Vishay+Siliconix/view-part/?ref=eda; DESCRIPTION: Si1308EDL-T1-GE3 N-channel MOSFET Transistor, 1.5 A, 30 V, 3-Pin SC-70 | Siliconix / Vishay SI1308EDL-T1-GE3; MF: Vishay Siliconix; MP: SI1308EDL-T1-GE3; PACKAGE: SOT-323 Vishay Semiconductor; PRICE: None; PURCHASE-URL: https://www.snapeda.com/api/url_track_click_mouser/?unipart_id=274603&manufacturer=Vishay Siliconix&part_name=SI1308EDL-T1-GE3&search_term=None; SNAPEDA_LINK: https://www.snapeda.com/parts/SI1308EDL-T1-GE3/Vishay+Siliconix/view-part/?ref=snap
R1_EP_DR R2 R2_EP_DR R3-R5 R7-R9 R17 R18 R_PWR_EPD R_TYPE_SEL = InkTime_v5:CPF0201D7K68C1_CPF0201D7K68C1: 7.68k 0201 Thin Film Surface Mount Fixed Resistor +/-0.5% 0.031W CPF0201D7K68C1 Source: Datasheet <http://www.te.com/commerce/DocumentDelivery/DDEController?Action=showdoc&DocId=Data Sheet1773200-1ApdfEnglishENG_DS_1773200-1_A.pdf4-2176215-6>
R1_USB R2_USB = InkTime_v5:ERA-1AEB3401C_CPF0201D7K68C1: 7.68k 0201 Thin Film Surface Mount Fixed Resistor +/-0.5% 0.031W CPF0201D7K68C1 Source: Datasheet <http://www.te.com/commerce/DocumentDelivery/DDEController?Action=showdoc&DocId=Data Sheet1773200-1ApdfEnglishENG_DS_1773200-1_A.pdf4-2176215-6>
SJ1 = InkTime_v5:ESP32_C6_LIBRARY_7_JUMPER_SJ: SMD solder JUMPER
SW_DN SW_ENT SW_UP = InkTime_v5:2025-10-22_07-23-44_LIBRARY_EVP-AKE31A; COPYRIGHT: Copyright (C) 2025 Ultra Librarian. All rights reserved.; DIGI-KEY_PART_NUMBER_1: P123437TR-ND; DIGI-KEY_PART_NUMBER_2: P123437CT-ND; DIGI-KEY_PART_NUMBER_3: P123437DKR-ND; MANUFACTURER_NAME: Panasonic; MANUFACTURER_PART_NUMBER: EVP-AKE31A
TP1-TP6 TP_3V3 TP_BAT_GND TP_ON TP_OP TP_SCL TP_SDA TP_VBAT TP_VREG = InkTime_v5:HECTOR_WATCH_1_TP: Test pad
U1 = InkTime_v5:NORDIC_NRF_4_NRF52840_QF: nRF52840 Features Advanced Single chip 2.4 GHz multi-protocol SoC 32-bit ARM Cortex-M4F Processor 1.7v to 5.5v operation 1MB flash + 256kB RAM Bluetooth 5 support for long range and high throughput 802.15.4 radio support On-chip NFC PPI –Programmable Peripheral Interconnect Automated power management system with automatic power management of each peripheral Configurable I/O mapping for analog and digital I/O 48 x GPIO 1 x QSPI 4 x Master/Slave SPI 2 x Two-wire interface (I²C) I²S interface 2 x UART 4 x PWM USB 2.0 controller ARM TrustZone CryptoCell-310 Cryptographic and security module AES 128-bit ECB/CCM/AAR hardware accelerator Digital microphone interface (PDM) Quadrature decoder 12-bit ADC Low power comparator On-chip 50Ω balun On-air compatible with nRF52, nRF51 and nRF24 Series Applications Advanced high performance wearables Wearables for secure payments Virtual Reality/Augmented Reality systems Smart Home sensor networks Smart city sensor networks High performance HID controllers Internet of Things (IoT) sensor networks Smart door locks Smart lighting networks Connected white goods
U3 = InkTime_v5:ESP32_C6_LIBRARY_MAX17048G+T10: Check availability <https://pricing.snapeda.com/parts/MAX17048G%2BT10/Analog%20Devices/view-part?ref=eda>; AVAILABILITY: In Stock; CHECK_PRICES: https://www.snapeda.com/parts/MAX17048G+T10/Analog+Devices/view-part/?ref=eda; DESCRIPTION: 3µA 1-Cell/2-Cell Fuel Gauge with ModelGauge; MF: Analog Devices; MP: MAX17048G+T10; PACKAGE: TDFN-8 Maxim; PRICE: None; PURCHASE-URL: https://www.snapeda.com/api/url_track_click_mouser/?unipart_id=329239&manufacturer=Analog Devices&part_name=MAX17048G+T10&search_term=None; SNAPEDA_LINK: https://www.snapeda.com/parts/MAX17048G+T10/Analog+Devices/view-part/?ref=snap
X1 = InkTime_v5:NORDIC_NRF_XTAL_32MHZ
X2 = InkTime_v5:NORDIC_NRF_1_XTAL_32KHZ

## Net classes
1 Power: width 0.3 mm

## Board
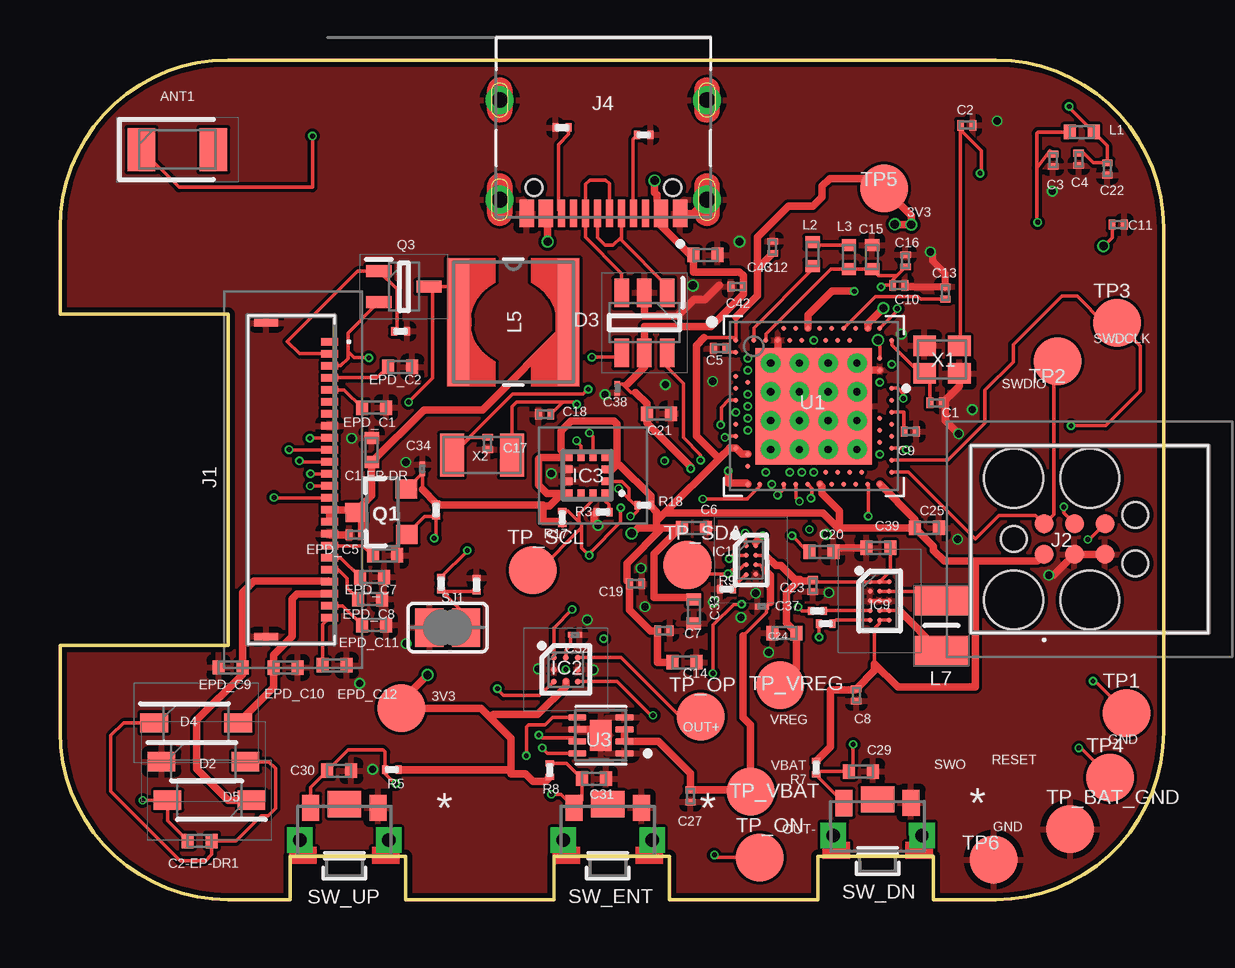
[diagram p2: board, top side]
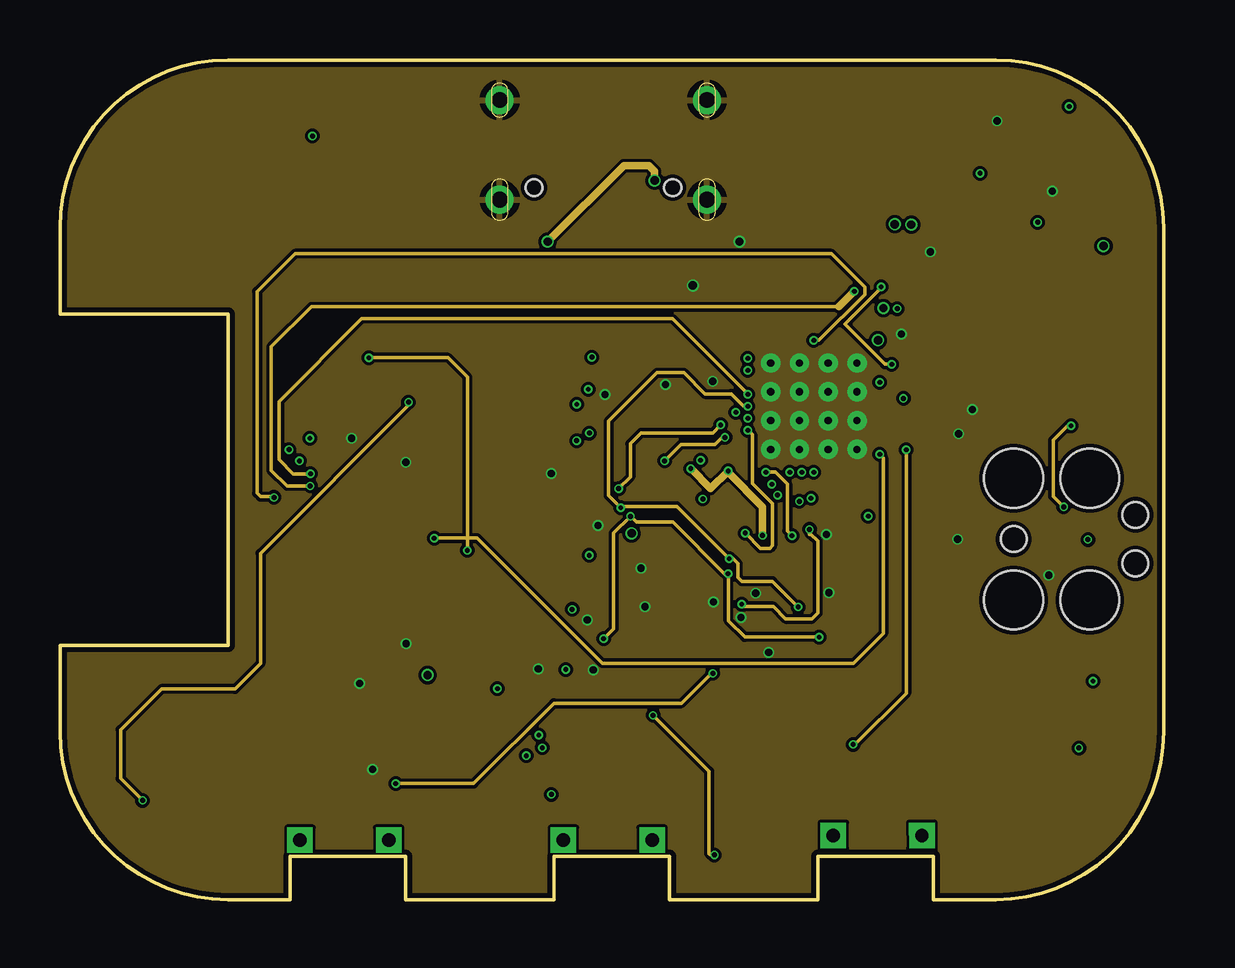
[diagram p3: board, inner layer Route2]
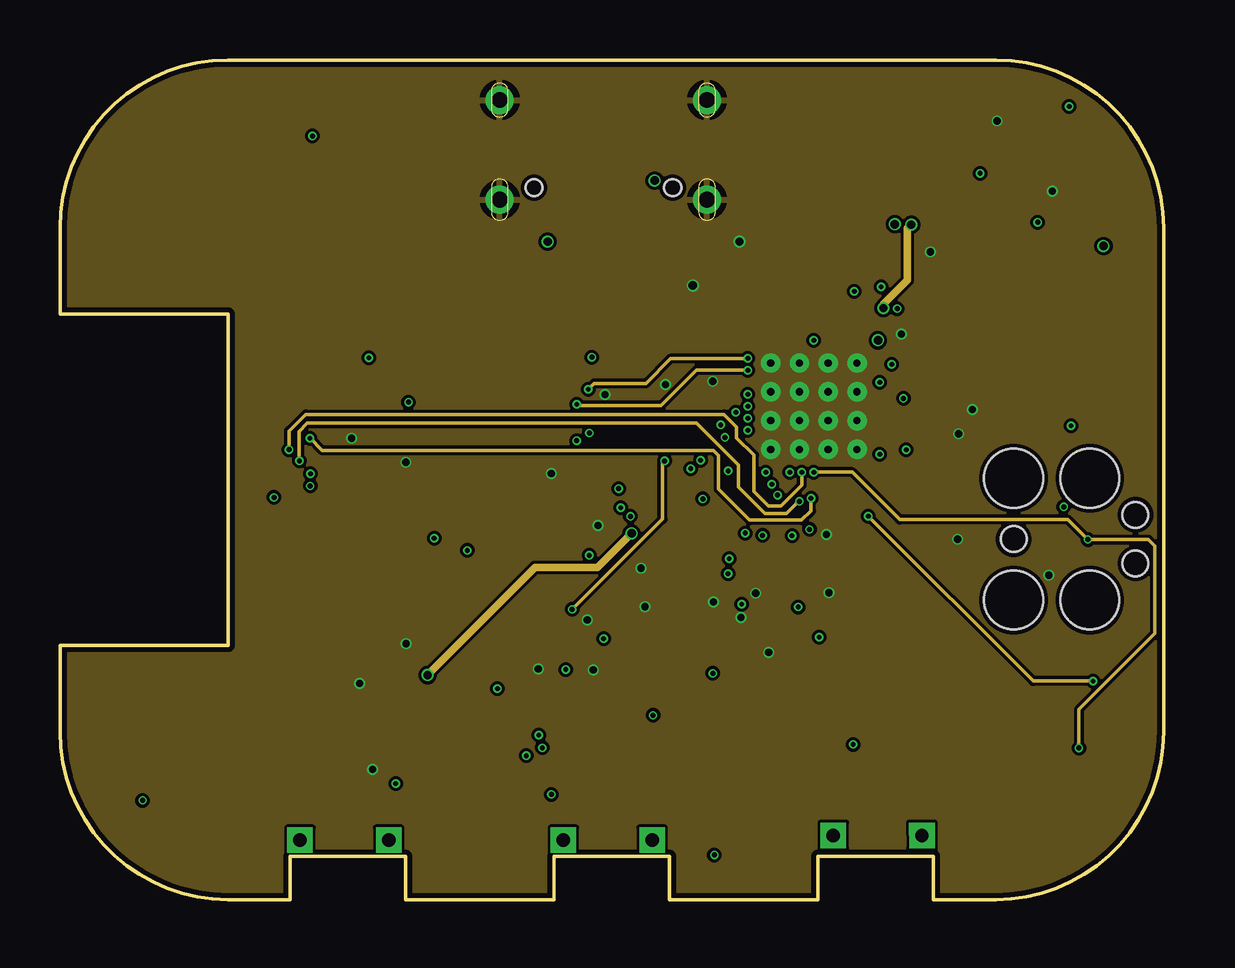
[diagram p4: board, inner layer Route15]
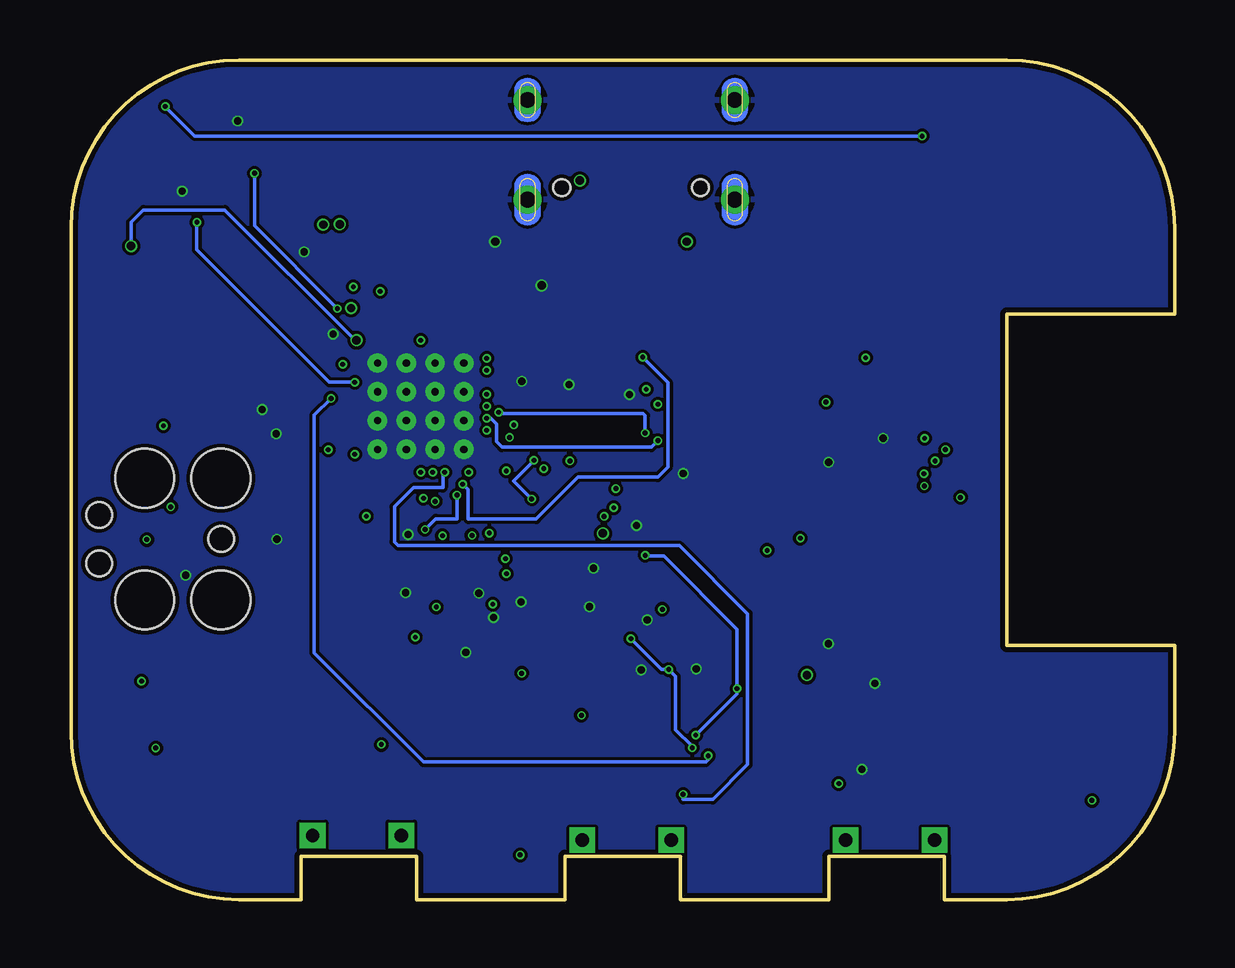
[diagram p5: board, bottom side, seen from below]

Size 46 x 35 mm. Coordinates in mm from the lower left corner, seen from the top.
Outline: 39,0 36.4,0 36.4,1.8 31.6,1.8 31.6,0 25.4,0 25.4,1.8 20.6,1.8 20.6,0 14.4,0 14.4,1.8 9.6,1.8 9.6,0 7,0 arc-90 0,7 0,10.6 7,10.6 7,24.4 0,24.4 0,28 arc-90 7,35 39,35 arc-90 46,28 46,7 arc-90 39,0
Copper layers (1+2*15+16): Top 0.035mm / dielectric 1.6mm / Route2 0.035mm / dielectric 0.15mm / Route15 0.035mm / dielectric 0.2mm / Bottom 0.035mm
Design rules "jlcpcb-2layers.dru *": minimum track width 0.15mm, minimum drill 0.2mm, track to track 5mil, track to pad 0.15mm, pad to pad 0.15mm, via to via 0.15mm, smd to smd 0.15mm, copper to edge 0.2mm, drill to drill 6mil, minimum pad ring 10mil, minimum via ring 0.075mm, stop-mask expansion 4mil, vias tented up to drill 0mil, thermal gap 10mil

### Footprints (pad centres in the part's own frame; a part is rotated, then mirrored left to right if it is on the bottom)
2450AT18B100E_ANTC3216X140N = smd 1.15 x 1.8: 1 -1.5,0; 2 1.5,0
NORDIC_NRF_3_RESC0201_L = smd 0.28 x 0.43: 1 -0.255,0; 2 0.255,0
NORDIC_NRF_3_RESC0402_L = smd 0.5 x 0.6: 1 -0.5,0; 2 0.5,0
GRM011R60J152KE01L_2_CAPC0201X13N = smd 0.22 x 0.23: 1 -0.185,0; 2 0.185,0
ESP32_C6_LIBRARY_5_SOD3716X135N = smd 1.15 x 0.8: 1 -1.75,0; 2 1.75,0
ESP32_C6_LIBRARY_3_SOT95P280X145-6N = smd 1.2 x 0.6: 1 -1.25,0.95; 2 -1.25,0; 3 -1.25,-0.95; 4 1.25,-0.95; 5 1.25,0; 6 1.25,0.95
BQ25180YBGR_BGA8C40P2X4_100X155X50 = smd 0.2 x 0.2: A1 -0.2,0.6; A2 0.2,0.6; B1 -0.2,0.2; B2 0.2,0.2; C1 -0.2,-0.2; C2 0.2,-0.2; D1 -0.2,-0.6; D2 0.2,-0.6
DRV2605YZFR_BGA9C50P3X3_144X144X62 = smd 0.25 x 0.25: A1 -0.5,0.5; A2 0,0.5; A3 0.5,0.5; B1 -0.5,0; B2 0,0; B3 0.5,0; C1 -0.5,-0.5; C2 0,-0.5; C3 0.5,-0.5
BMA423_BMA423 = smd 0.3 x 0.35: 1 -0.75,-0.775; 2 -0.25,-0.775; 3 0.25,-0.775; 4 0.75,-0.775; 7 0.75,0.775; 8 0.25,0.775; 9 -0.25,0.775; 10 -0.75,0.775 | smd 0.35 x 0.3: 5 0.775,-0.25; 6 0.775,0.25; 11 -0.775,0.25; 12 -0.775,-0.25
RT6160AWSC_BGA15C40P3X5_140X230X60 = smd 0.216 x 0.216: A1 -0.4,0.8; A2 0,0.8; A3 0.4,0.8; B1 -0.4,0.4; B2 0,0.4; B3 0.4,0.4; C1 -0.4,0; C2 0,0; C3 0.4,0; D1 -0.4,-0.4; D2 0,-0.4; D3 0.4,-0.4; E1 -0.4,-0.8; E2 0,-0.8; E3 0.4,-0.8
503480-2400_5034802400 = smd 0.3 x 0.7: 1 -5.75,1.525; 2 -5.25,1.525; 3 -4.75,1.525; 4 -4.25,1.525; 5 -3.75,1.525; 6 -3.25,1.525; 7 -2.75,1.525; 8 -2.25,1.525; 9 -1.75,1.525; 10 -1.25,1.525; 11 -0.75,1.525; 12 -0.25,1.525; 13 0.25,1.525; 14 0.75,1.525; 15 1.25,1.525; 16 1.75,1.525; 17 2.25,1.525; 18 2.75,1.525; 19 3.25,1.525; 20 3.75,1.525; 21 4.25,1.525; 22 4.75,1.525; 23 5.25,1.525; 24 5.75,1.525 | smd 0.3 x 1: MP1 -6.54,-1.125; MP2 6.54,-1.125
TC2030-IDC_TC2030IDC = smd 0.783 x 0.783: 1 -0.953,-0.635; 2 -0.953,0.635; 3 0.317,-0.635; 4 0.317,0.635; 5 1.588,-0.635; 6 1.588,0.635 | hole 2.451: -2.223,-2.54; -2.223,2.54; 0.952,-2.54; 0.952,2.54 | hole 1.067: -2.223,0; 2.857,-1.016; 2.857,1.016
KH-TYPE-C-16P_KINGHELM_KH-TYPE-C-16P = smd 0.6 x 1.15: A1_B12 -3.2,4.725; A4_B9 -2.4,4.725; A9_B4 2.4,4.725; A12_B1 3.2,4.725 | smd 0.3 x 1.15: A5 -1.25,4.725; A6 -0.25,4.725; A7 0.25,4.725; A8 1.25,4.725; B5 1.75,4.725; B6 0.75,4.725; B7 -0.75,4.725; B8 -1.75,4.725 | drill 0.65 pad 1.05: SH1 -4.32,0; SH2 4.32,0; SH3 -4.32,4.15; SH4 4.32,4.15 | hole 0.7: -2.89,3.65; 2.89,3.65
NORDIC_NRF_2_RESC0402_L = smd 0.5 x 0.6: 1 -0.5,0; 2 0.5,0
ESP32_C6_LIBRARY_2_IND_4828-WE-TPC_WRE = smd 0.9 x 5.3: 1 -2.286,0; 2 2.286,0
MLP2016SR47MT0S1_INDC2016X100N = smd 1.2 x 2.2: 1 -1.028,0; 2 1.028,0
ESP32_C6_LIBRARY_4_ESP32_C6_LIBRARY_4_ESP32_C6_LIBRARY_4_ESP32_C6_LIBRARY_4_ESP32_WROVER_SPARKFUN-DISCRETESEMI_SOT23-3 = smd 0.8 x 0.9: 1 -0.95,-1; 2 0.95,-1; 3 0,1.1
ESP32_C6_LIBRARY_6_SOT65P210X110-3N = smd 1.05 x 0.5: 1 -1.05,0.65; 2 -1.05,-0.65; 3 1.05,0
CPF0201D7K68C1_0201 = smd 0.35 x 0.25: 1 0,0.275; 2 0,-0.275
ERA-1AEB3401C_0201 = smd 0.35 x 0.25: 1 0,0.275; 2 0,-0.275
ESP32_C6_LIBRARY_7_JUMPER_SJ = smd 1.168 x 1.6: 1 -0.762,0; 2 0.762,0
2025-10-22_07-23-44_LIBRARY_SW_EVP-AKE31A_PAN = smd 0.711 x 1.092: 1 -1.4,-0.972; 2 1.4,-0.972 | drill 0.559 pad 0.914 square: 3 -1.848,0.381; 4 1.848,0.381 | smd 1.397 x 1.092: 5 0,-1.124
HECTOR_WATCH_1_TP20R = smd 2 x 2: TP 0,0
NORDIC_NRF_4_AQFN50P700X700X85_HS-74N = smd 4.85 x 4.85: P$74 0,0 | drill 0.3 pad 0.6: P$75 -1.8,1.8; P$76 -0.6,1.8; P$77 0.6,1.8; P$78 1.8,1.8; P$79 -1.8,0.6; P$80 -0.6,0.6; P$81 0.6,0.6; P$82 1.8,0.6; P$83 -1.8,-0.6; P$84 -0.6,-0.6; P$85 0.6,-0.6; P$86 1.8,-0.6; P$87 -1.8,-1.8; P$88 -0.6,-1.8; P$89 0.6,-1.8; P$90 1.8,-1.8 | smd 0.2 x 0.2: P$A8 -1.25,3.25; P$A10 -0.75,3.25; P$A12 -0.25,3.25; P$A14 0.25,3.25; P$A16 0.75,3.25; P$A18 1.25,3.25; P$A20 1.75,3.25; P$A22 2.25,3.25; P$A23 2.75,3.25; P$AA24 3.25,-2.25; P$AB2 -2.75,-2.5; P$AC5 -2,-2.75; P$AC9 -1,-2.75; P$AC11 -0.5,-2.75; P$AC13 0,-2.75; P$AC15 0.5,-2.75; P$AC17 1,-2.75; P$AC19 1.5,-2.75; P$AC21 2,-2.75; P$AC24 3.25,-2.75; P$AD2 -2.75,-3.25; P$AD4 -2.25,-3.25; P$AD6 -1.75,-3.25; P$AD8 -1.25,-3.25; P$AD10 -0.75,-3.25; P$AD12 -0.25,-3.25; P$AD14 0.25,-3.25; P$AD16 0.75,-3.25; P$AD18 1.25,-3.25; P$AD20 1.75,-3.25; P$AD22 2.25,-3.25; P$AD23 2.75,-3.25; P$B1 -3.25,2.75; P$B3 -2.5,2.75; P$B5 -2,2.75; P$B7 -1.5,2.75; P$B9 -1,2.75; P$B11 -0.5,2.75; P$B13 0,2.75; P$B15 0.5,2.75; P$B17 1,2.75; P$B19 1.5,2.75; P$B24 3.25,2.75; P$C1 -3.25,2.25; P$D2 -2.75,2; P$D23 2.75,2; P$E24 3.25,1.75; P$F2 -2.75,1.5; P$F23 2.75,1.5; P$G1 -3.25,1.25; P$H2 -2.75,1; P$H23 2.75,1; P$J1 -3.25,0.75; P$J24 3.25,0.75; P$K2 -2.75,0.5; P$L1 -3.25,0.25; P$L24 3.25,0.25; P$M2 -2.75,0; P$N1 -3.25,-0.25; P$N24 3.25,-0.25; P$P2 -2.75,-0.5; P$P23 2.75,-0.5; P$R1 -3.25,-0.75; P$R24 3.25,-0.75; P$T2 -2.75,-1; P$T23 2.75,-1; P$U1 -3.25,-1.25; P$U24 3.25,-1.25; P$V23 2.75,-1.5; P$W1 -3.25,-1.75; P$W24 3.25,-1.75; P$Y2 -2.75,-2; P$Y23 2.75,-2
ESP32_C6_LIBRARY_SON50P200X200X80-9N = smd 0.76 x 0.27: 1 -0.985,0.75; 2 -0.985,0.25; 3 -0.985,-0.25; 4 -0.985,-0.75; 5 0.985,-0.75; 6 0.985,-0.25; 7 0.985,0.25; 8 0.985,0.75 | smd 0.9 x 1.3: 9 0,0
NORDIC_NRF_BT-XTAL_2016_N = smd 0.95 x 0.85: 1 -0.725,-0.575; 2 0.725,-0.575; 3 0.725,0.575; 4 -0.725,0.575
NORDIC_NRF_1_XTAL_3215_N = smd 1 x 1.8: 1 -1.25,0; 2 1.25,0

### Placement (x,y rotation side)
ANT1  4.89,31.26 0 top
C1  36.52,20.7 0 top
C1-EP-DR  12.99,18.73 90 top
C2  37.79,32.28 0 top
C2-EP-DR1  5.83,2.44 180.3 top
C3  41.39,30.82 270 top
C4  42.46,30.86 270 top
C5  27.5,22.98 180 top
C6  26.42,15.49 0 top
C7  25.17,11.21 0 top
C8  33.19,8.53 270 top
C9  35.44,19.51 0 top
C10  34.97,25.61 180 top
C11  44.11,28.14 0 top
C12  29.7,27.19 90 top
C13  36.91,25.29 270 top
C14  26.03,9.9 0 top
C15  33.85,26.78 90 top
C16  35.24,26.62 90 top
C17  17.83,19.01 90 top
C18  20.21,20.23 0 top
C19  24,13.17 0 top
C20  31.73,14.5 0 top
C21  24.96,20.25 0 top
C22  43.65,30.46 270 top
C23  31.38,13.09 89.8 top
C24  30.19,11.11 0 top
C25  36.14,15.49 0 top
C27  26.28,4.32 270 top
C29  33.4,5.34 0 top
C30  11.64,5.37 0 top
C31  22.25,5.04 0 top
C32  21.47,11.04 180 top
C33  26.42,12 270 top
C34  15.11,17.96 270 top
C37  29.26,12.21 0 top
C38  23.24,21.31 90 top
C39  34.11,14.66 180 top
C42  28.23,25.55 180 top
C43  26.91,26.87 0 top
D2  5.98,5.75 0 top
D3  24.36,24.04 270 top
D4  5.68,7.36 0 top
D5  6.24,4.14 180 top
EPD_C1  13.09,20.5 180 top
EPD_C2  14.18,22.21 180 top
EPD_C5  12.31,15.21 0 top
EPD_C6  13.54,14.35 180 top
EPD_C7  13.01,13.44 180 top
EPD_C8  12.93,12.53 180 top
EPD_C9  7.11,9.68 0 top
EPD_C10  9.42,9.67 180 top
EPD_C11  13.09,11.44 180 top
EPD_C12  11.45,9.76 180 top
IC1  28.8,14.15 0.4 top
IC2  21.08,9.59 0 top
IC3  21.97,17.69 90 top
IC9  34.16,12.45 0 top
J1  9.72,17.5 270 top
J2  41.97,15.02 0 top
J4  22.65,33.33 180 top
L1  42.59,31.99 0 top
L2  31.37,26.9 270 top
L3  32.88,26.78 90 top
L5  18.9,24.07 0 top
L7  36.74,11.42 270 top
Q1  13.45,16.15 90.5 top
Q3  14.34,25.55 0 top
R1_EP_DR  15.89,13.16 180 top
R1_USB  24.33,31.88 270 top
R2  31.92,11.5 90 top
R2_EP_DR  14.2,23.69 270 top
R2_USB  20.93,32.18 270 top
R3  22.63,16.15 89.8 top
R4  31.57,12.03 90 top
R5  13.83,5.42 90 top
R7  31.52,5.5 180 top
R8  20.42,5.4 0 top
R9  27.78,12.94 90 top
R17  20.94,15.93 180 top
R18  24.35,16.44 270 top
R_PWR_EPD  15.68,16.24 180 top
R_TYPE_SEL  17.37,13.13 0 top
SJ1  16.16,11.34 0 top
SW_DN  34.08,3.05 180.1 top
SW_ENT  22.83,2.85 180 top
SW_UP  11.85,2.85 180 top
TP1  44.46,7.78 0 top
TP2  41.59,22.43 0 top
TP3  44.07,24.04 0 top
TP4  43.78,5.09 0 top
TP5  34.36,29.64 0 top
TP6  38.92,1.66 0 top
TP_3V3  14.23,7.97 0 top
TP_BAT_GND  42.11,2.93 0 top
TP_ON  29.18,1.75 0 top
TP_OP  26.7,7.62 0 top
TP_SCL  19.7,13.72 0 top
TP_SDA  26.16,13.95 0 top
TP_VBAT  28.78,4.5 0 top
TP_VREG  30.02,8.94 0 top
U1  31.42,20.57 0 top
U3  22.55,6.84 180 top
X1  36.77,22.51 0 top
X2  17.59,18.53 180 top

### Tracks (layer width: path | path; a pad name or v marks a point on that pad's centre or on a via)
3V3  (via drill 0.35)
  Top 0.152: 28.17,24.28 U1.P$B1 28.07,23.42 26.84,23.42 | 15.11,17.08 C34.2 | C34.2 | 33.96,9.83 33.96,11.3 34.16,11.51 IC9.E2 IC9.E3 | Q1.2 15.09,17.77 C34.2
  Top 0.305: C12.1 29.06,26.29 | 15.11,17.08 R_PWR_EPD.2 15.75,16.44 20.14,16.44 20.14,16.42 | 20.14,16.42 20.41,16.42 20.93,16.94 IC3.10 20.3,16.94 19.95,17.29 19.95,18.36 20.02,18.44 IC3.7 20.89,18.74 20.89,19.54 21.31,19.96 23.09,19.96 23.23,19.82 23.23,18.15 23.2,18.12 | 23.2,18.12 22.98,17.9 22.74,17.9 IC3.3 | 20.14,16.42 20.14,15.75 20.94,15.75 R17.1 | C14.1 24.92,9.9 C7.1 24.61,11.21 23.74,12.07 C19.1 23.63,13.28 23.63,14.01 25.1,15.49 C6.1 | C33.1 26.32,12.6 24.76,12.6 24.76,14.41 25.84,15.49 C6.1 | C6.1 24.09,15.49 23.86,15.27 v23.83,15.27 | 24.87,15.78 24.87,15.49 C6.1 | U1.P$Y2 28.42,18.57 U1.P$W1 27.91,18.82 27.9,18.81 | 27.9,18.81 27.47,18.37 | 27.47,18.37 25.21,16.12 | 25.21,16.12 24.87,15.78 | 27.52,18.43 27.9,18.81 | 27.9,18.81 | 26.84,23.42 26.53,23.1 26.53,19.32 27.47,18.38 27.47,18.37 | R7.2 32.11,6.36 32.11,8.74 33.15,8.74 C8.1 33.96,9.55 33.96,9.83 34.92,8.86 38.16,8.86 38.16,14.11 | C25.1 36.42,14.71 36.42,14.56 36.86,14.11 38.16,14.11 | U1.P$AD23 35.64,15.85 C25.1 | U1.P$AD14 31.76,17.23 31.76,16.93 32.49,16.2 32.49,15.49 | 32.49,15.49 32.49,15.43 31.81,16.12 25.21,16.12 | C25.1 32.49,15.49 | TP5.TP 34.2,29.47 | 28.17,24.28 29.06,25.17 29.06,26.29 | J2.1 40.74,14.11 38.16,14.11 | R5.2 18.8,5.42 | R8.2 20.23,4.93 19.71,4.93 19.4,5.24 18.8,5.24 18.8,5.42 | IC2.C2 21.09,8.88 19.91,7.71 18.07,7.71 17.94,7.58 | 18.8,5.42 18.8,6.72 17.94,7.58 | 17.94,7.58 17.55,7.97 TP_3V3.TP 14.08,8.11 v15.32,9.35 | 24.87,15.78 24.87,16.16 24.63,16.41 R18.1 24.63,16.82 23.32,18.12 23.2,18.12 | 29.06,26.29 29.06,27.61 30.36,28.91 31.39,28.91 31.76,29.28 31.76,29.73 32.09,30.06 33.95,30.06 34.36,29.65 TP5.TP
  Top 0.305: TP5.TP 35.48,28.51 v35.48,28.14 34.81,28.14 v34.8,28.15 | v34.32,24.66 33.67,24.01 U1.P$A22
  Route15 0.305: v35.48,28.14 35.33,27.98 35.33,25.83 34.32,24.82 v34.32,24.66 | v15.32,9.35 19.81,13.84 22.4,13.84 v23.83,15.27
ALERT  (via drill 0.2)
  Top 0.152: U1.P$J24 34.92,21.32 35.16,21.08 v35.16,20.89 | v19.44,5.99 19.44,7.21 19.52,7.29 20.22,7.29 20.52,7.59 U3.5
  Bottom 0.152: v35.16,20.89 35.86,20.19 35.86,10.28 31.31,5.74 19.54,5.74 19.36,5.91 v19.44,5.99
D+  (via drill 0.2)
  Top 0.152: D3.4 23.23,22.61 v22.18,22.61 v22.17,22.61
  Bottom 0.152: v22.17,22.61 21.12,21.56 21.12,18.02 21.54,17.61 24.86,17.61 26.61,15.86 29.45,15.86 29.45,17.09 U1.P$AD6
  other vias: 29.67,17.32
D-  (via drill 0.2)
  Top 0.152: U1.P$AD4 29.17,17.24 28.65,16.72 28.65,16.7 v26.8,16.7 | D3.6 25.31,22.19 25.98,21.52 25.98,19.25 26.7,18.53 v26.7,18.31
  Bottom 0.152: v26.7,18.31 27.56,17.46 v26.8,16.7
DN
  Top 0.152: J4.A7 22.4,27.59 22.71,27.28 23.06,27.28 23.4,27.62 | J4.B7 23.4,27.62 | 23.4,27.62 23.4,27.48 25.31,25.57 D3.1
DP
  Top 0.152: D3.3 23.41,26.09 21.9,27.6 J4.B6 21.9,29.81 22.08,30 22.74,30 22.9,29.83 J4.A6
EPD_3V3
  Top 0.305: 12.32,16.17 12.24,16.25 J1.15 J1.16 | 12.32,16.17 Q1.3 12.57,15.92 EPD_C5.2 | 12.32,16.17 12.99,16.84 C1-EP-DR.1 15.17,20.41 17.61,20.41 21.18,23.99 L5.2
EPD_BUSY  (via drill 0.2)
  Top 0.152: J1.9 v10.43,19.24 v10.42,19.23 | v31.31,16.73 31.35,16.77 31.35,17.14 U1.P$AD12
  Route15 0.152: v10.42,19.23 10.93,18.72 27.23,18.72 27.45,18.5 27.45,17.11 28.74,15.81 30.92,15.81 31.31,16.2 v31.31,16.73
EPD_CS  (via drill 0.2)
  Top 0.152: J1.12 v10.45,17.75
  Route2 0.152: U1.P$K2 25.53,24.21 12.58,24.21 9.13,20.76 9.13,18.35 9.73,17.75 v10.45,17.75
  other vias: 28.67,21.07
EPD_DC  (via drill 0.2)
  Top 0.152: J1.11 10.01,18.25 v9.98,18.28 | v30.82,16.6 30.67,16.75 U1.P$AD10
  Route15 0.152: v9.98,18.28 9.96,18.3 9.96,19.51 10.31,19.86 26.53,19.86 28.28,18.11 28.28,17.2 29.38,16.1 30.28,16.1 30.78,16.6 v30.82,16.6
EPD_RST  (via drill 0.2)
  Top 0.152: v9.55,18.75 v9.56,18.75 J1.10
  Route15 0.152: v9.55,18.75 9.55,19.54 10.24,20.23 27.68,20.23 28.21,19.7 28.21,19.25 28.93,18.52 28.93,17 29.53,16.4 30.05,16.4 30.92,17.28 U1.P$AC11
  other vias: 30.92,17.82
GDR
  Top 0.152: R2_EP_DR.2 14.05,23.81 14.05,25.44 Q3.1 12.41,26.2 9.48,23.26 9.99,22.75 J1.2
GND  (via drill 0.3, 0.35)
  Top 0.152: IC9.C3 IC9.C2 IC9.C1 | R3.1 22.26,16.05
  Top 0.3: C10.1 35.3,25.53 36.89,25.53 C13.1 36.91,26.09 36.37,26.63 36.37,26.92 v36.28,27
  Top 0.305: J4.SH3 26.4,28.6 J4.A1_B12 | D3.2 24.36,24.32 25.74,24.32 26.43,25.01 26.89,25.01 27.49,25.62 | J2.5 J2.3 41.43,13.52 v41.22,13.52 | U3.6 22.3,7.09 U3.9 | C39.2 32.4,14.66 C20.2 | U1.P$F23 33.52,22.07 U1.P$78 | EPD_C5.1 11.29,15.21 J1.17 | U1.P$B7 29.92,22.67 U1.P$75 | v22.43,15.59 22.26,15.76 22.26,16.05 | U1.P$74 U1.P$84 | v37.45,19.42 36.9,19.97 36.9,20.7 C1.2 37.48,21.41 X1.2
  other vias: 39.06,32.45 41.37,29.53 12.49,9.01 13.03,5.43 14.43,10.67 27.21,21.6 38.04,20.42 35.07,23.57 20.48,17.77 14.42,18.23 12.15,19.23 22.23,9.57 19.94,9.61 21.98,11.66 37.42,15.02 32.06,12.79 31.95,15.22 22.72,21.05 25.24,21.47 24.22,13.81 24.38,12.21 29,12.77 27.23,12.41 28.39,11.75 29.54,10.3 28.32,27.43 26.38,25.6
  pour Top: 8.08,-6.57 52.34,-6.57 52.34,28.75 44.3,36.8 -2.91,36.83 -2.91,4.42
  pour Route2: 7.55,-7.41 52.16,-7.41 52.16,25.82 40.44,37.54 -2.18,37.63 -2.18,2.31
  pour Route15: 5.22,-7.23 52.05,-7.23 52.05,30.69 44.21,38.53 -1.24,38.38 -1.24,-0.77
  pour Bottom: 2.85,-7.69 51.67,-7.69 51.67,33.14 45.81,38.99 -0.63,39.07 -0.63,-4.2
HAPTIC_EN  (via drill 0.2)
  Top 0.152: IC2.A1 20.59,11.33 v21.35,12.09 | v27.72,19.26 27.77,19.32 U1.P$U1
  Route2 0.152: v25.2,18.28 25.89,18.97 27.3,18.97 27.6,19.26 v27.72,19.26
  Route15 0.152: v21.35,12.09 25.12,15.86 25.12,18.28 v25.2,18.28
IMU_INT1  (via drill 0.2)
  Top 0.152: v22.07,19.45 22.22,19.3 IC3.5
  Bottom 0.152: U1.P$N1 28.11,20.26 22.16,20.26 22.07,20.17 v22.07,19.45
  other vias: 28.17,20.32
IMU_INT2  (via drill 0.2)
  Top 0.152: IC3.6 21.72,18.91 21.52,19.11 v21.54,19.13
  Bottom 0.152: v21.54,19.13 21.8,18.86 28.03,18.86 28.26,19.09 28.26,19.82 28.51,20.07 U1.P$P2
  other vias: 28.67,20.07
LX1
  Top 0.152: 36.33,12.85 IC9.B3 IC9.B2
  Top 0.305: 36.33,12.85 L7.1
LX2
  Top 0.152: IC9.D2 IC9.D3 34.98,12.05
  Top 0.305: 34.98,12.05 36.64,10.39 L7.2
MOSI  (via drill 0.2)
  Top 0.152: v8.92,16.76 8.94,16.75 J1.14
  Route2 0.152: U1.P$B13 31.64,23.32 33.55,25.22 33.55,25.53 32.16,26.92 9.8,26.92 8.22,25.35 8.22,16.94 8.36,16.79 8.89,16.79 v8.92,16.76
  other vias: 31.42,23.32
N$1
  Top 0.152: U1.P$C1 27.91,22.82 C5.1
N$2
  Top 0.152: U1.P$N24 35.18,20.32 C9.1
N$3  (via drill 0.35)
  Top 0.152: 43.86,27.95 C11.1 43.86,27.6 v43.5,27.24 | v34.1,23.31 34.17,23.24 U1.P$D23
  Bottom 0.152: v43.5,27.24 43.5,28.24 42.99,28.75 39.6,28.75 34.16,23.31 v34.1,23.31
N$4
  Top 0.152: R4.2 31.86,12.05 IC9.D1
N$5  (via drill 0.2)
  Top 0.152: v22.02,21.27 22.01,21.27 21.81,21.07 18.86,21.07 16.34,18.55 X2.2 17.08,19.27 C17.2
  Route15 0.152: U1.P$D2 28.65,22.54 25.45,22.54 24.42,21.51 22.26,21.51 v22.02,21.27
  other vias: 28.67,22.57
N$6  (via drill 0.2)
  Top 0.152: v21.54,20.65 21.44,20.74 20.9,20.74 | 20.9,20.74 19.03,20.74 18.84,20.55 X2.1 | C18.2 20.9,20.67 20.9,20.74
  Route15 0.152: U1.P$F2 26.52,22.07 25.05,20.6 21.59,20.6 v21.54,20.65
  other vias: 28.67,22.07
N$7  (via drill 0.2)
  Top 0.152: L5.1 17.09,25.55 Q3.3 15.53,25.4 15.53,21.74 v14.53,20.74 | C2-EP-DR1.2 4.49,3.28 D5.2 v3.46,4.14 v3.45,4.13
  Route2 0.152: v14.53,20.74 14.53,20.61 8.36,14.43 8.36,9.84 7.29,8.78 4.24,8.78 2.53,7.07 2.53,5.05 v3.45,4.13
N$9  (via drill 0.2)
  Top 0.152: L1.1 40.76,31.99 40.72,31.94 40.72,30.5 | 40.72,30.5 40.72,28.27 v40.75,28.24 | 40.72,30.5 41.25,31.22 C3.1 | U1.P$H23 | U1.P$H23
  Bottom 0.152: v40.75,28.24 40.75,27.09 35.23,21.56 U1.P$H23
  other vias: 34.17,21.56
N$10  (via drill 0.2)
  Top 0.152: C4.1 42.68,31.11 43.08,30.71 C22.1 43.65,31.43 L1.2 42.07,33.01 v42.07,33.06 | 3.55,31.26 ANT1.1 4.97,29.69 10.53,29.69 v10.53,31.83
  Bottom 0.152: v10.53,31.83 40.84,31.83 v42.07,33.06
N$12  (via drill 0.2)
  Top 0.152: L3.1 32.14,26.28 29.42,23.56 U1.P$B5 | L3.1 C15.1 34.12,26.01 34.89,26.01 C16.1 34.71,25.84 C10.2 34.29,25.61 v34.23,25.55 | L3.1
  Route2 0.152: U1.P$E24 34.39,22.32 32.72,23.99 34.23,25.5 v34.23,25.55
  other vias: 34.67,22.32
N$13  (via drill 0.2)
  Top 0.152: X1.3 37.53,23.12 37.53,32.29 C2.1 37.54,32.1 38.41,31.23 38.41,30.34 v38.35,30.28 | U1.P$A23 34.9,24.54 v34.9,24.63
  Bottom 0.152: v34.9,24.63 38.35,28.08 v38.35,30.28
N$14
  Top 0.152: C1.1 36.26,21.71 X1.1 35.86,21.93 34.67,23.12 U1.P$B24
N$15
  Top 0.152: L3.2 31.49,27.28 L2.1
N$16
  Top 0.152: L2.2 31.37,26.27 28.92,23.82 U1.P$B3
N$17
  Top 0.152: U1.P$A18 33.99,25.14 35.77,25.14 35.88,25.03 C13.2
N$18
  Top 0.152: IC3.1 22.74,16.59 22.88,16.46 22.88,16.19 R3.2
N$19  (via drill 0.2)
  Top 0.152: v30.51,15.17 31.19,14.5 C20.1
  Route2 0.152: U1.P$AC5 29.82,17.82 30.32,17.32 30.32,15.37 v30.51,15.17
  other vias: 29.42,17.82
N$21
  Top 0.152: R2.2 32.34,11.65 IC9.E1
N$23
  Top 0.152: J1.20 11.61,13.75 11.96,13.4 11.96,13 EPD_C8.2
N$24
  Top 0.152: R9.2 28.05,13.01 28.59,13.55 IC1.D1
N$25
  Top 0.152: D2.2 8.71,5.75 8.99,5.47 8.99,3.8 8.68,3.49 8.38,3.49 7.34,2.44 C2-EP-DR1.1 6.33,1.88 6.07,1.61 5.02,1.61 2.12,4.51 2.12,6.83 2.65,7.36 D4.1
N$27
  Top 0.152: J1.4 13.22,21.75 EPD_C2.2
N$29
  Top 0.152: SJ1.2 17.18,11.59 R1_EP_DR.1 15.93,12.85 R_TYPE_SEL.2
N$31
  Top 0.152: J1.5 11.84,21.25 EPD_C1.2
N$32
  Top 0.152: IC2.A2 21.09,10.4 21.28,10.59 C32.2
N$34
  Top 0.15: R2_USB.1 21.2,31.9 20.77,31.47 20.77,28.73 J4.B5
N$37
  Top 0.15: R1_USB.2 23.88,31.7 23.88,28.62
  Top 0.152: 23.88,28.62 J4.A5
N$39
  Top 0.152: J1.19 11.7,14.25 EPD_C7.2
N$41
  Top 0.152: J1.18 12.64,14.75 EPD_C6.2
N$42
  Top 0.152: J1.23 11.79,12.25 12.59,11.45 EPD_C11.2
N$44
  Top 0.152: J1.24 10.95,11.46 EPD_C12.2
OUT+
  Top 0.152: IC2.A3 23.4,10.09 25.87,7.62 TP_OP.TP
OUT-  (via drill 0.2)
  Top 0.152: IC2.C3 23.23,9.09 24.64,7.68 v24.72,7.68 | v27.28,1.86 27.38,1.75 TP_ON.TP
  Route2 0.152: v24.72,7.68 27.05,5.34 27.05,1.91 27.11,1.86 v27.28,1.86
P0.13  (via drill 0.2)
  Top 0.152: SW_UP.2 10.46,4.68 C30.1 12.02,6.24 13.46,6.24 13.56,6.15 R5.1 13.56,5.23 13.96,4.84 v13.99,4.84 | U1.P$AD8 30.17,17.11 v29.91,16.86 | v27.21,9.43 27.21,11.44 28.09,12.31 v28.42,12.31
  Route2 0.152: v13.99,4.84 17.24,4.84 20.59,8.18 25.9,8.18 27.15,9.43 v27.21,9.43 | v28.42,12.31 28.52,12.21 29.75,12.21 30.25,11.71 31.35,11.71 31.58,11.95 31.58,14.95 31.31,15.23 31.24,15.23 v31.24,15.43
  Bottom 0.152: v31.24,15.43 30.8,15.87 29.91,15.87 v29.91,16.86
P0.14  (via drill 0.2)
  Top 0.152: R8.1 21.12,5.67 C31.1 21.75,4.15 SW_ENT.2 20.88,4.38 v20.49,4.38
  Bottom 0.152: 30.45,17.82 U1.P$AC9 30.49,17.75 30.49,17.17 31.73,17.17 32.52,16.38 32.52,14.92 32.36,14.76 20.64,14.76 17.79,11.91 17.79,5.63 19.25,4.17 20.49,4.17 v20.49,4.38
  other vias: 30.42,17.82
P1.01  (via drill 0.2)
  Top 0.152: Q1.1 15.2,15.96 R_PWR_EPD.1 15.68,15.14 v15.6,15.06
  Route2 0.152: U1.P$Y23 34.32,18.42 34.32,11.1 33.07,9.84 22.62,9.84 17.39,15.06 v15.6,15.06
  other vias: 34.17,18.57
P1.02  (via drill 0.2)
  Top 0.152: R7.1 31.64,5.34 C29.1 33.06,5.51 v33.06,6.47 | R7.1 31.56,5.26 31.6,5.1 SW_DN.2 31.52,5.18 R7.1 | U1.P$W24 35.25,18.82 35.3,18.77 v35.28,18.75
  Route2 0.152: v35.28,18.75 35.28,8.6 33.14,6.47 v33.06,6.47
PMIC_INT  (via drill 0.2)
  Top 0.152: v28.56,15.28 28.58,15.26 28.58,14.77 IC1.A1
  Route2 0.152: U1.P$T2 28.86,19.38 28.86,17.34 29.7,16.5 29.7,14.75 29.59,14.64 29.2,14.64 v28.56,15.28 | v28.56,15.28
  other vias: 28.67,19.57
PREVGH
  Top 0.305: J1.21 11.21,13.29 8.09,13.29 7.61,12.8 EPD_C9.2 7.61,9.39 5.7,7.48 5.7,5.46 7.02,4.14 D5.1
PREVGL
  Top 0.305: J1.22 9.89,12.75 9.68,12.53 9.68,10.96 8.92,10.2 EPD_C10.2 8.92,8.85 D4.2
RESE  (via drill 0.2)
  Top 0.152: J1.3 11.7,22.25 12.01,22.55 12.01,22.85 | Q3.2 12.01,23.61 12.01,22.85 | v16.98,14.55 16.98,14.54 R1_EP_DR.2 | v12.87,22.58 12.27,22.58 12.01,22.85
  Route2 0.152: v16.98,14.55 16.98,21.78 16.18,22.58 v12.87,22.58
RESET  (via drill 0.2)
  Top 0.152: J2.6 42.91,15.01 v42.85,15.01 | v42.47,6.32 42.55,6.32 TP4.TP
  Route15 0.152: U1.P$AC13 33.03,17.82 35,15.84 42.01,15.84 v42.85,15.01 | 42.07,15.79 v42.85,15.01 | v42.85,15.01 45.37,15.01 45.64,14.74 45.64,11.09 42.47,7.92 v42.47,6.32
  other vias: 31.42,17.82
SCK  (via drill 0.2)
  Top 0.152: J1.13 v10.43,17.24
  Top 0.305: v33.11,25.36 32.17,25.36 31.17,24.36 U1.P$A12
  Route2 0.152: v10.43,17.24 9.46,17.24 8.81,17.89 8.81,23.04 10.48,24.71 32.47,24.71
  Route2 0.305: 32.47,24.71 v33.11,25.36
SCL  (via drill 0.2)
  Top 0.152: R4.1 30.93,12.03 v30.77,12.2 | v27.89,14.21 28.04,14.36 28.05,14.35 IC1.B1 | 21.64,15.75 21.64,16.07 22.22,16.65 IC3.12 | 21.75,15.46 21.75,15.64 21.64,15.75 | 21.75,15.46 21.75,14.66 v22.06,14.35 22.06,14.43 23.37,15.74 v23.37,16.33 | 21.75,15.46 21.73,15.48 19.97,13.72 TP_SCL.TP | R17.2 21.18,16.2 21.64,15.75 | IC2.C1 20,8.5 18.48,8.5 18.24,8.75 v18.24,8.79 | U3.7 21.43,6.73 20.09,6.73 v19.96,6.86
  Route2 0.152: v30.77,12.2 29.7,13.26 28.42,13.26 28.25,13.43 28.25,14.01 28.05,14.21 v27.89,14.21 25.72,16.39 23.43,16.39 v23.37,16.33 22.87,16.84 22.87,19.94 24.89,21.96 26,21.96 26.88,21.08 27.98,21.08 28.5,20.57 U1.P$M2
  Bottom 0.152: v22.06,14.35 22.03,14.31 21.28,14.31 18.24,11.27 v18.24,8.79 18.24,8.58 v19.96,6.86
  other vias: 28.67,20.57
SDA  (via drill 0.2)
  Top 0.152: R2.1 v31.64,10.94 v31.65,10.94 | v23.78,15.97 23.85,15.97 24.08,16.2 R18.2 23.96,16.44 23.73,16.68 | 23.73,16.68 v23.28,17.12 v23.29,17.13 | 23.73,16.68 23.72,16.68 23.72,17.14 23.43,17.44 IC3.2 | U3.8 20.33,6.09 v20.1,6.32 | v27.54,19.78 27.58,19.82 27.58,20.52 27.87,20.82 U1.P$L1 | TP_SDA.TP 26.52,13.58 v27.85,13.58 28,13.73 28.3,13.73 28.52,13.95 IC1.C1
  Route2 0.152: v31.65,10.94 28.55,10.94 27.87,11.62 27.87,13.58 v27.85,13.58 27.7,13.58 25.55,15.73 24.02,15.73 v23.78,15.97 23.08,15.27 23.08,11.29 v22.66,10.87 | v27.54,19.78 27.21,19.45 24.22,19.45 23.77,19.01 23.77,17.62 v23.29,17.13
  Bottom 0.152: v20.1,6.32 20.1,6.39 20.79,7.08 20.79,9.3 IC2.B2 21.38,9.59 v22.66,10.87
  other vias: 21.08,9.59
SWDCLK  (via drill 0.2)
  Top 0.152: U1.P$AA24 37.01,18.32 38.56,19.87 38.56,21.24 39.74,22.42 39.74,23.14 41.75,25.15 42.4,25.15 42.42,25.13 43.52,24.03 TP3.TP 45.04,23.07 45.04,21.2 43.59,19.75 v42.15,19.75 | J2.4 41.84,16.11 v41.84,16.37
  Route2 0.152: v41.84,16.37 41.41,16.81 41.41,19.15 42.01,19.75 v42.15,19.75
SWDIO
  Top 0.152: TP2.TP 41.42,22.26 41.42,16.06 J2.2 40.66,16.02 39.13,16.02 38.15,15.04 35.37,17.82 U1.P$AC24
SWO  (via drill 0.2)
  Top 0.152: U1.P$AD22 33.69,17.3 v33.69,15.98 | TP1.TP 43.14,9.1 v43.06,9.1
  Route15 0.152: v43.06,9.1 40.56,9.1 v33.69,15.98
VBAT
  Top 0.152: 28.48,11 29.44,11.96 C37.2 29.61,12.38 | IC1.C2 29.17,13.95 29.38,13.75
  Top 0.305: 29.38,13.75 29.61,13.51 29.61,12.38 | 28.48,11 28.48,7.59 28.78,7.28 TP_VBAT.TP 28.71,4.57 C27.1 26.28,5.26 24.95,6.59 U3.2 U3.3
VBUS  (via drill 0.2, 0.35)
  Top 0.152: 23.66,21.5 C38.2 23.44,21.5 23.8,21.14 24,21.14 | 29,14.89 IC1.A2
  Top 0.305: 23.66,21.5 24.36,22.2 D3.5 24.36,23.88 27.13,23.88 28.48,25.23 C42.1 28.48,26.01 28.32,26.17 26.41,26.17 C43.1 26.27,26.87 25.05,28.09 J4.A4_B9 25.05,28.96 24.88,29.13 24.88,29.38 24.79,29.47 v24.79,29.97 | 24,21.14 24.46,20.67 C21.1 24.46,19.87 26.3,18.04 v26.3,17.96 | v27.86,17.87 27.86,17.37 28.62,17.37 U1.P$AD2 | J4.A9_B4 20.33,28.52 v20.33,27.43 | v29.28,15.18 29,14.89
  Route2 0.305: v24.79,29.97 24.79,30.36 24.55,30.6 23.5,30.6 v20.33,27.43 | v26.3,17.96 27.12,17.14 v27.86,17.87 27.86,17.8 29.28,16.37 v29.28,15.18
VREG
  Top 0.152: C39.1 34.61,13.69 IC9.A2 | IC9.A2 IC9.A3 | IC9.A2 IC9.A1 31.48,13.25 31.45,13.28 | 29.42,14.35 IC1.B2 | C23.2 31.45,13.28 | 31.45,13.28
  Top 0.305: 29.42,14.35 29.85,13.92 30.06,13.92 30.64,13.34 30.85,13.34 30.79,13.28 | 31.45,13.28 30.79,13.28 | TP_VREG.TP 30.69,9.61 C24.2 30.28,11.52 30.28,12.77 30.79,13.28
(copper drawn outside any net)
  shapes: Bottom area x1, Route15 area x1, Route2 area x1, Top area x1

### Text on the board
tPlace: 3V3 | SWDCLK | SWDIO | 3V3 | OUT+ | VREG | GND | VBAT | SWO | RESET | GND | OUT-